# Altium project PRL_PDC.PrjPcb (part 1 of 2)
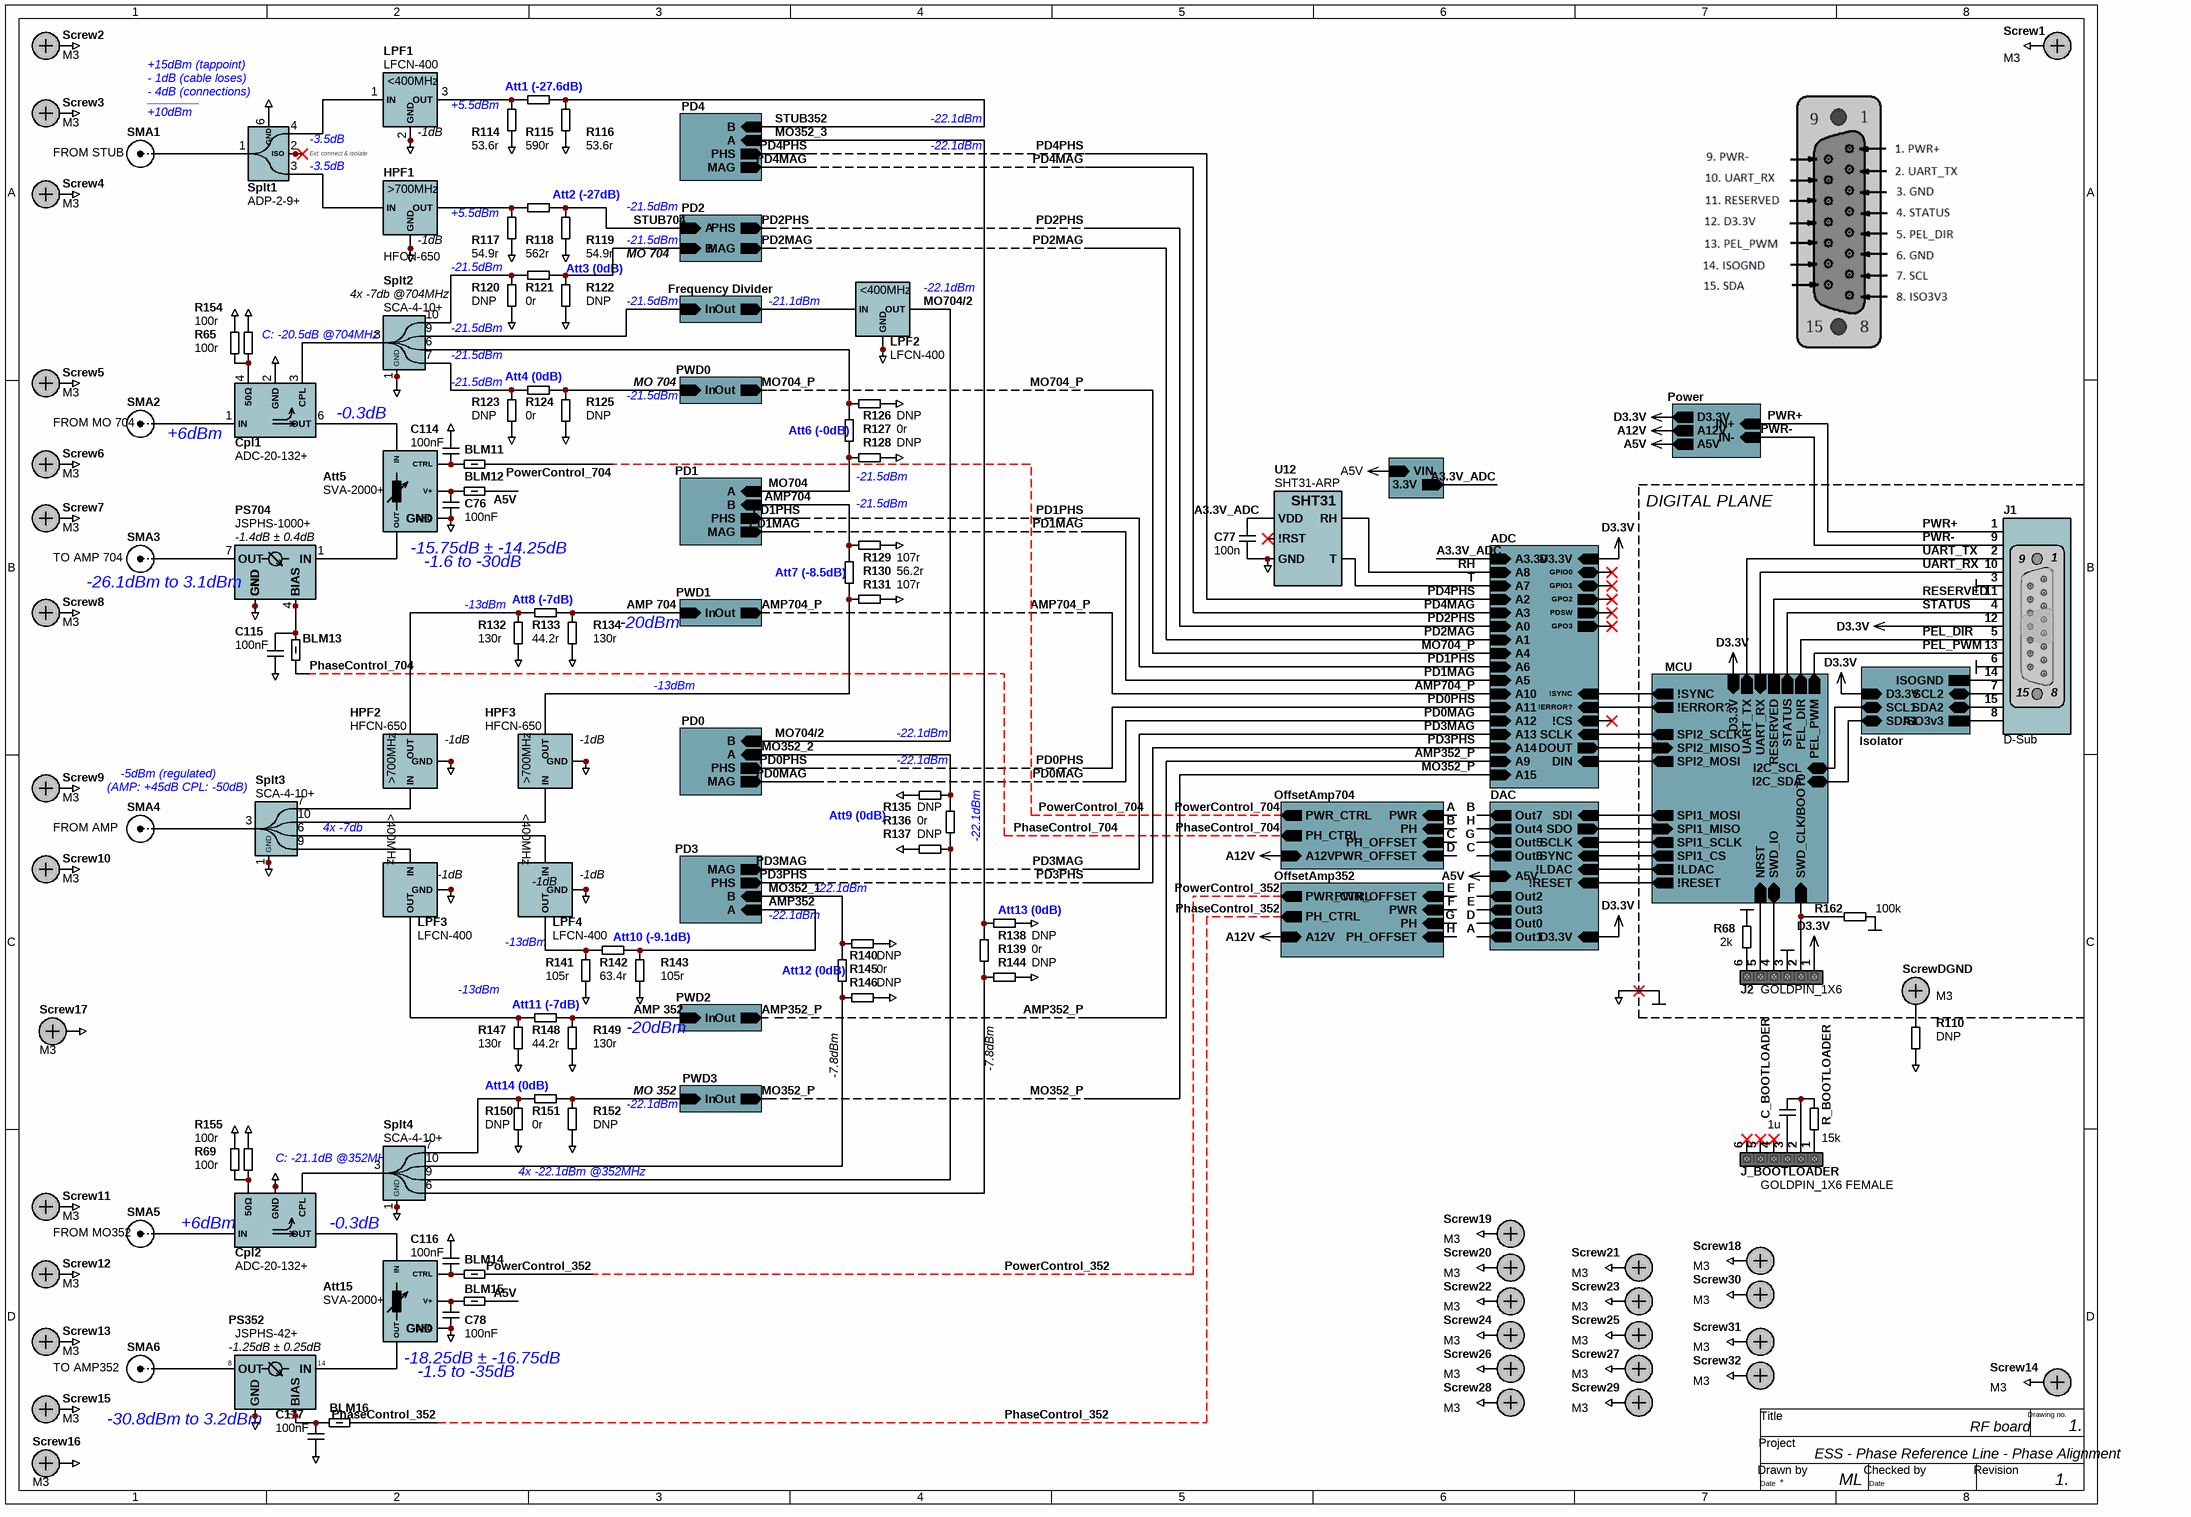
[diagram p0: RF.SchDoc]
Project_CopyrightDate: 2019; Project_DrawnBy: ML; Project_Engineer: Mateusz Lipinski; Project_Revision: 1; Project_Title: PRL Phase Drift Compensation
11 sheets, 570 parts. Net scope: hierarchical (ports join the sheet entries above them; power ports are global).
Board file: RF.PcbDoc
Sheets:
  RF.SchDoc
    PD2 = PhaseDetector.SchDoc
      A3.3V_PhD = LDO3v3.SchDoc
    PD1 = PhaseDetector.SchDoc
      A3.3V_PhD = LDO3v3.SchDoc
    PD3 = PhaseDetector.SchDoc
      A3.3V_PhD = LDO3v3.SchDoc
    PD0 = PhaseDetector.SchDoc
      A3.3V_PhD = LDO3v3.SchDoc
    Frequency Divider = FreqDiv.SchDoc
      A3.3V_FD = LDO3v3.SchDoc
    PD4 = PhaseDetector.SchDoc
      A3.3V_PhD = LDO3v3.SchDoc
    DAC = DAC.SchDoc
    ADC = ADC.SchDoc
    PWD0 = PowerDetector.SchDoc
      A3.3V_PD = LDO3v3.SchDoc
    PWD1 = PowerDetector.SchDoc
      A3.3V_PD = LDO3v3.SchDoc
    PWD2 = PowerDetector.SchDoc
      A3.3V_PD = LDO3v3.SchDoc
    PWD3 = PowerDetector.SchDoc
      A3.3V_PD = LDO3v3.SchDoc
    Power = Power.SchDoc
    MCU = MCU.SchDoc
    Isolator = Isolator.SchDoc
    A3.3V_ADC = LDO3v3.SchDoc
    OffsetAmp704 = OffsetAmplifier.SchDoc
    OffsetAmp352 = OffsetAmplifier.SchDoc

## Sheet RF.SchDoc
size 393 x 281 mm; DocumentNumber: 5; SheetNumber: 5; SheetTotal: 11

### Parts
Att5  SVA-2000+  [FZ990]
Att15  SVA-2000+  [FZ990]
BLM11  120 Ohms @ 100MHz  [0402-Inductor]  (value not drawn)
BLM12  120 Ohms @ 100MHz  [0402-Inductor]  (value not drawn)
BLM13  120 Ohms @ 100MHz  [0402-Inductor]  (value not drawn)
BLM14  120 Ohms @ 100MHz  [0402-Inductor]  (value not drawn)
BLM15  120 Ohms @ 100MHz  [0402-Inductor]  (value not drawn)
BLM16  120 Ohms @ 100MHz  [0402-Inductor]  (value not drawn)
C76  100nF  [0603-Capacitor]
C77  100n  [0402-Capacitor]
C78  100nF  [0603-Capacitor]
C114  100nF  [0603-Capacitor]
C115  100nF  [0603-Capacitor]
C116  100nF  [0603-Capacitor]
C117  100nF  [0603-Capacitor]
C_BOOTLOADER  1u  [0603-Capacitor]  (no BOM)
Cpl1  ADC-20-132+  [CD542]
Cpl2  ADC-20-132+  [CD542]
HPF1  HFCN-650  [FV1206]
HPF2  HFCN-650  [FV1206]
HPF3  HFCN-650  [FV1206]
J1  D-Sub  [AE10105-ND]
J2  GOLDPIN_1X6  [HDR_1x6 SMD]
J_BOOTLOADER  GOLDPIN_1X6 FEMALE  [HDR_1x6 SMD]  (no BOM)
LPF1  LFCN-400  [FV1206]
LPF2  LFCN-400  [FV1206]
LPF3  LFCN-400  [FV1206]
LPF4  LFCN-400  [FV1206]
PS352  JSPHS-42+  [BK276]
PS704  JSPHS-1000+  [BK276]
R65  100r  [0402-RESISTOR]
R68  2k  [0402-RESISTOR]
R69  100r  [0402-RESISTOR]
R110  DNP  [0402-RESISTOR]  (no BOM)
R114  53.6r  [0603-RESISTOR]
R115  590r  [0603-RESISTOR]
R116  53.6r  [0603-RESISTOR]
R117  54.9r  [0603-RESISTOR]
R118  562r  [0603-RESISTOR]
R119  54.9r  [0603-RESISTOR]
R120  DNP  [0603-RESISTOR]  (no BOM)
R121  0r  [0603-RESISTOR]
R122  DNP  [0603-RESISTOR]  (no BOM)
R123  DNP  [0603-RESISTOR]  (no BOM)
R124  0r  [0603-RESISTOR]
R125  DNP  [0603-RESISTOR]  (no BOM)
R126  DNP  [0603-RESISTOR]  (no BOM)
R127  0r  [0603-RESISTOR]
R128  DNP  [0603-RESISTOR]  (no BOM)
R129  107r  [0603-RESISTOR]
R130  56.2r  [0603-RESISTOR]
R131  107r  [0603-RESISTOR]
R132  130r  [0603-RESISTOR]
R133  44.2r  [0603-RESISTOR]
R134  130r  [0603-RESISTOR]
R135  DNP  [0603-RESISTOR]  (no BOM)
R136  0r  [0603-RESISTOR]
R137  DNP  [0603-RESISTOR]  (no BOM)
R138  DNP  [0603-RESISTOR]  (no BOM)
R139  0r  [0603-RESISTOR]
R140  DNP  [0603-RESISTOR]  (no BOM)
R141  105r  [0603-RESISTOR]
R142  63.4r  [0603-RESISTOR]
R143  105r  [0603-RESISTOR]
R144  DNP  [0603-RESISTOR]  (no BOM)
R145  0r  [0603-RESISTOR]
R146  DNP  [0603-RESISTOR]  (no BOM)
R147  130r  [0603-RESISTOR]
R148  44.2r  [0603-RESISTOR]
R149  130r  [0603-RESISTOR]
R150  DNP  [0603-RESISTOR]  (no BOM)
R151  0r  [0603-RESISTOR]
R152  DNP  [0603-RESISTOR]  (no BOM)
R154  100r  [0402-RESISTOR]
R155  100r  [0402-RESISTOR]
R162  100k  [0402-RESISTOR]
R_BOOTLOADER  15k  [0603-RESISTOR]  (no BOM)
Screw1  M3  [M3 Screw]
Screw2  M3  [M3 Screw]
Screw3  M3  [M3 Screw]
Screw4  M3  [M3 Screw]
Screw5  M3  [M3 Screw]
Screw6  M3  [M3 Screw]
Screw7  M3  [M3 Screw]
Screw8  M3  [M3 Screw]
Screw9  M3  [M3 Screw]
Screw10  M3  [M3 Screw]
Screw11  M3  [M3 Screw]
Screw12  M3  [M3 Screw]
Screw13  M3  [M3 Screw]
Screw14  M3  [M3 Screw]
Screw15  M3  [M3 Screw]
Screw16  M3  [M3 Screw]
Screw17  M3  [M3 Screw]
Screw18  M3  [M3 Screw]
Screw19  M3  [M3 Screw]
Screw20  M3  [M3 Screw]
Screw21  M3  [M3 Screw]
Screw22  M3  [M3 Screw]
Screw23  M3  [M3 Screw]
Screw24  M3  [M3 Screw]
Screw25  M3  [M3 Screw]
Screw26  M3  [M3 Screw]
Screw27  M3  [M3 Screw]
Screw28  M3  [M3 Screw]
Screw29  M3  [M3 Screw]
Screw30  M3  [M3 Screw]
Screw31  M3  [M3 Screw]
Screw32  M3  [M3 Screw]
ScrewDGND  M3  [M3 Screw]
SMA1  FROM STUB  [MC000242]
SMA2  FROM MO 704  [MC000242]
SMA3  TO AMP 704  [MC000242]
SMA4  FROM AMP  [MC000242]
SMA5  FROM MO352  [MC000242]
SMA6  TO AMP352  [MC000242]
Splt1  ADP-2-9+  [CD636]
Splt2  SCA-4-10+  [DZ943]
Splt3  SCA-4-10+  [DZ943]
Splt4  SCA-4-10+  [DZ943]
U12  SHT31-ARP  [TDFN-8 SHT3X-ARP]

### Sub-sheets
A3.3V_ADC = LDO3v3.SchDoc: 3.3V (out), VIN (in)
ADC = ADC.SchDoc: A11 (in), A13 (in), A0 (in), A6 (in), A3 (in), A2 (in), A5 (in), A12 (in), A10 (in), A1 (in), A8 (in), A14 (in), A4 (in), A7 (in), A15 (in), A9 (in), SCLK (in), DIN (in), DOUT (out), D3.3V (in), !ERROR? (in), !SYNC (in), A3.3V (in), GPIO0 (bidir), GPIO1 (bidir), GPO2 (out), PDSW (out), GPO3 (out), !CS (in)
DAC = DAC.SchDoc: Out4 (out), Out6 (out), Out2 (out), Out3 (out), Out7 (out), Out1 (out), Out0 (out), Out5 (out), !SYNC (in), SDI (in), SCLK (in), SDO (out), !LDAC (in), D3.3V (in), A5V (in), !RESET (in)
Frequency Divider = FreqDiv.SchDoc: In (in), Out (out)
Isolator = Isolator.SchDoc: SDA2 (bidir), ISO3v3, SCL2 (bidir), ISOGND, SDA1 (bidir), D3.3V (in), SCL1 (bidir)
MCU = MCU.SchDoc: NRST (in), SWD_CLK/BOOT0 (in), SWD_IO (bidir), !ERROR? (out), !SYNC (out), !LDAC (out), I2C_SDA (bidir), PEL_DIR (out), UART_TX (out), I2C_SCL (bidir), STATUS (out), PEL_PWM (out), RESERVED, UART_RX (in), D3.3V (in), SPI1_CS (out), SPI1_MOSI (out), SPI1_SCLK (out), SPI2_MISO (in), SPI2_SCLK (out), SPI2_MOSI (out), SPI1_MISO (in), !RESET (out)
OffsetAmp352 = OffsetAmplifier.SchDoc: PWR_OFFSET (in), PWR (in), PH_OFFSET (in), PH (in), PWR_CTRL (out), PH_CTRL (out), A12V (in)
OffsetAmp704 = OffsetAmplifier.SchDoc: PWR_OFFSET (in), PWR (in), PH_OFFSET (in), PH (in), PWR_CTRL (out), PH_CTRL (out), A12V (in)
PD0 = PhaseDetector.SchDoc: MAG (out), PHS (out), A (in), B (in)
PD1 = PhaseDetector.SchDoc: MAG (out), PHS (out), A (in), B (in)
PD2 = PhaseDetector.SchDoc: MAG (out), PHS (out), A (in), B (in)
PD3 = PhaseDetector.SchDoc: MAG (out), PHS (out), A (in), B (in)
PD4 = PhaseDetector.SchDoc: MAG (out), PHS (out), A (in), B (in)
Power = Power.SchDoc: IN- (in), IN+ (in), D3.3V (out), A12V (out), A5V (out)
PWD0 = PowerDetector.SchDoc: Out (out), In (in)
PWD1 = PowerDetector.SchDoc: Out (out), In (in)
PWD2 = PowerDetector.SchDoc: Out (out), In (in)
PWD3 = PowerDetector.SchDoc: In (in), Out (out)

### Nets
A5V: BLM12.2 BLM15.2 ; sheet DAC/A5V, sheet Power/A5V, sheet A3.3V_ADC/VIN
A12V: sheet Power/A12V, sheet OffsetAmp704/A12V, sheet OffsetAmp352/A12V
D3.3V: J1.12 J2.1 ; sheet DAC/D3.3V, sheet ADC/D3.3V, sheet Power/D3.3V, sheet MCU/D3.3V, sheet Isolator/D3.3V
DGND: Att5.2(GND) Att5.3(GND) Att5.5(GND) Att5.6(GND) Att5.7(GND) Att5.9(GND) Att5.10(GND) Att5.12(GND) Att15.2(GND) Att15.3(GND) Att15.5(GND) Att15.6(GND) Att15.7(GND) Att15.9(GND) Att15.10(GND) Att15.12(GND) C76.2 C77.1 C78.2 C114.1 C115.2 C116.1 C117.2 Cpl1.2(GND) Cpl2.2(GND) HPF1.2(GND) HPF1.4(GND) HPF2.2(GND) HPF2.4(GND) HPF3.2(GND) HPF3.4(GND) J1.3 J1.6 J2.3 LPF1.2(GND) LPF1.4(GND) LPF2.2(GND) LPF2.4(GND) LPF3.2(GND) LPF3.4(GND) LPF4.2(GND) LPF4.4(GND) PS352.2(GND) PS352.3(GND) PS352.4(GND) PS352.5(GND) PS352.6(GND) PS352.9(GND) PS352.10(GND) PS352.11(GND) PS352.12(GND) PS352.13(GND) PS704.2(GND) PS704.3(GND) PS704.5(GND) PS704.8(GND) PS704.9(GND) PS704.10(GND) PS704.11(GND) PS704.12(GND) PS704.13(GND) PS704.14(GND) R65.2 R68.1 R69.2 R110.2 R114.1 R116.1 R117.1 R119.1 R120.1 R122.1 R123.1 R125.1 R126.1 R128.1 R129.1 R131.1 R132.1 R134.1 R135.1 R137.1 R138.1 R140.1 R141.1 R143.1 R144.1 R146.1 R147.1 R149.1 R150.1 R152.1 R154.2 R155.2 R162.1 Screw1.0 Screw2.0 Screw3.0 Screw4.0 Screw5.0 Screw6.0 Screw7.0 Screw8.0 Screw9.0 Screw10.0 Screw11.0 Screw12.0 Screw13.0 Screw14.0 Screw15.0 Screw16.0 Screw17.0 Screw18.0 Screw19.0 Screw20.0 Screw21.0 Screw22.0 Screw23.0 Screw24.0 Screw25.0 Screw26.0 Screw27.0 Screw28.0 Screw29.0 Screw30.0 Screw31.0 Screw32.0 Splt1.6(GND) Splt2.1(GND) Splt2.2(GND) Splt2.4(GND) Splt2.5(GND) Splt2.8(GND) Splt3.1(GND) Splt3.2(GND) Splt3.4(GND) Splt3.5(GND) Splt3.8(GND) Splt4.1(GND) Splt4.2(GND) Splt4.4(GND) Splt4.5(GND) Splt4.8(GND) U12.2(GND) U12.3(GND) U12.7(GND) U12.8(GND) U12.EP  [also labelled GND]
A: sheet DAC/Out1, sheet OffsetAmp704/PWR
A3.3V_ADC: C77.2 U12.5(VDD) ; sheet ADC/A3.3V, sheet A3.3V_ADC/3.3V
AMP352: R142.2 R143.2 ; sheet PD3/A
AMP352_P: sheet ADC/A9, sheet PWD2/Out
AMP704: R129.2 R130.2 ; sheet PD1/B
AMP704_P: sheet ADC/A10, sheet PWD1/Out
B: sheet DAC/Out7, sheet OffsetAmp704/PH
C: sheet DAC/Out6, sheet OffsetAmp704/PH_OFFSET
D: sheet DAC/Out0, sheet OffsetAmp704/PWR_OFFSET
E: sheet DAC/Out3, sheet OffsetAmp352/PWR_OFFSET
F: sheet DAC/Out2, sheet OffsetAmp352/PWR
G: sheet DAC/Out5, sheet OffsetAmp352/PH
H: sheet DAC/Out4, sheet OffsetAmp352/PH_OFFSET
MO352_1: R140.2 R145.2 ; sheet PD3/B
MO352_2: R135.2 R136.2 ; sheet PD0/A
MO352_3: R138.2 R139.2 ; sheet PD4/A
MO352_P: sheet ADC/A15, sheet PWD3/Out
MO704: R127.1 R128.2 ; sheet PD1/A
MO704/2: LPF2.3(OUT) ; sheet PD0/B
MO704_P: sheet ADC/A4, sheet PWD0/Out
NRST: J2.5 ; sheet MCU/NRST
PD0MAG: sheet PD0/MAG, sheet ADC/A12
PD0PHS: sheet PD0/PHS, sheet ADC/A11
PD1MAG: sheet PD1/MAG, sheet ADC/A5
PD1PHS: sheet PD1/PHS, sheet ADC/A6
PD2MAG: sheet PD2/MAG, sheet ADC/A1
PD2PHS: sheet PD2/PHS, sheet ADC/A0
PD3MAG: sheet PD3/MAG, sheet ADC/A13
PD3PHS: sheet PD3/PHS, sheet ADC/A14
PD4MAG: sheet PD4/MAG, sheet ADC/A3
PD4PHS: sheet PD4/PHS, sheet ADC/A2
PEL_DIR: J1.5 ; sheet MCU/PEL_DIR
PEL_PWM: J1.13 ; sheet MCU/PEL_PWM
PhaseControl_352: BLM16.2 ; sheet OffsetAmp352/PH_CTRL
PhaseControl_704: BLM13.1 ; sheet OffsetAmp704/PH_CTRL
PowerControl_352: BLM14.2 ; sheet OffsetAmp352/PWR_CTRL
PowerControl_704: BLM11.1 ; sheet OffsetAmp704/PWR_CTRL
PWR+: J1.1 ; sheet Power/IN+
PWR-: J1.9 ; sheet Power/IN-
RESERVED: J1.11 ; sheet MCU/RESERVED
RH: U12.1(RH) ; sheet ADC/A8
STATUS: J1.4 ; sheet MCU/STATUS
STUB352: R115.2 R116.2 ; sheet PD4/B
STUB704: R118.2 R119.2 ; sheet PD2/A
T: U12.4(T) ; sheet ADC/A7
UART_RX: J1.10 ; sheet MCU/UART_RX
UART_TX: J1.2 ; sheet MCU/UART_TX
NetAtt5_1: Att5.1(OUT) PS704.1(IN)
NetAtt5_4: Att5.4(CTRL) BLM11.2 C114.2
NetAtt5_8: Att5.8(IN) Cpl1.6(OUT)
NetAtt5_11: Att5.11(V+) BLM12.1 C76.1
NetAtt15_1: Att15.1(OUT) PS352.14(IN)
NetAtt15_4: Att15.4(CTRL) BLM14.1 C116.2
NetAtt15_8: Att15.8(IN) Cpl2.6(OUT)
NetAtt15_11: Att15.11(V+) BLM15.1 C78.1
NetBLM13_2: BLM13.2 C115.1 PS704.4(BIAS) PS704.6(BIAS)
NetBLM16_1: BLM16.1 C117.1 PS352.1(BIAS) PS352.7(BIAS)
NetC8_PD2_1: R121.2 R122.2 ; sheet PD2/B
NetC71_PWD0_1: R124.2 R125.2 ; sheet PWD0/In
NetC71_PWD1_1: R133.2 R134.2 ; sheet PWD1/In
NetC71_PWD2_1: R148.2 R149.2 ; sheet PWD2/In
NetC71_PWD3_1: R151.2 R152.2 ; sheet PWD3/In
NetC80_1: J1.14 ; sheet Isolator/ISOGND
NetC80_2: J1.8 ; sheet Isolator/ISO3v3
NetC_BOOTLOADER_1: C_BOOTLOADER.1 J_BOOTLOADER.3
NetC_BOOTLOADER_2: C_BOOTLOADER.2 J_BOOTLOADER.2 R_BOOTLOADER.2
NetCpl1_1: Cpl1.1(IN) SMA2.0(RF)
NetCpl1_3: Cpl1.3(CPL) Splt2.3(S)
NetCpl1_4: Cpl1.4(50Ω) R65.1 R154.1
NetCpl2_1: Cpl2.1(IN) SMA5.0(RF)
NetCpl2_3: Cpl2.3(CPL) Splt4.3(S)
NetCpl2_4: Cpl2.4(50Ω) R69.1 R155.1
NetHPF1_1: HPF1.1(IN) Splt1.3(P1)
NetHPF1_3: HPF1.3(OUT) R117.2 R118.1
NetHPF2_1: HPF2.1(IN) Splt3.7(P2)
NetHPF2_3: HPF2.3(OUT) R132.2 R133.1
NetHPF3_1: HPF3.1(IN) Splt3.10(P4)
NetHPF3_3: HPF3.3(OUT) R130.1 R131.2
NetJ1_7: J1.7 ; sheet Isolator/SCL2
NetJ1_15: J1.15 ; sheet Isolator/SDA2
NetJ2_2: J2.2 R162.2 ; sheet MCU/SWD_CLK/BOOT0
NetJ2_4: J2.4 ; sheet MCU/SWD_IO
NetJ2_6: J2.6 R68.2
NetJ_BOOTLOADER_1: J_BOOTLOADER.1 R_BOOTLOADER.1
NetLPF1_1: LPF1.1(IN) Splt1.4(P2)
NetLPF1_3: LPF1.3(OUT) R114.2 R115.1
NetLPF2_1: LPF2.1(IN) ; sheet Frequency Divider/Out
NetLPF3_1: LPF3.1(IN) Splt3.9(P3)
NetLPF3_3: LPF3.3(OUT) R147.2 R148.1
NetLPF4_1: LPF4.1(IN) Splt3.6(P1)
NetLPF4_3: LPF4.3(OUT) R141.2 R142.1
NetPS352_8: PS352.8(OUT) SMA6.0(RF)
NetPS704_7: PS704.7(OUT) SMA3.0(RF)
NetR23_2: sheet DAC/!RESET, sheet MCU/!RESET
NetR83_1: sheet ADC/SCLK, sheet MCU/SPI2_SCLK
NetR84_1: sheet ADC/DIN, sheet MCU/SPI2_MOSI
NetR85_1: sheet ADC/DOUT, sheet MCU/SPI2_MISO
NetR86_1: sheet DAC/SDI, sheet MCU/SPI1_MOSI
NetR87_1: sheet DAC/SDO, sheet MCU/SPI1_MISO
NetR88_1: sheet DAC/SCLK, sheet MCU/SPI1_SCLK
NetR89_1: sheet DAC/!SYNC, sheet MCU/SPI1_CS
NetR92_1: sheet MCU/I2C_SDA, sheet Isolator/SDA1
NetR94_1: sheet MCU/I2C_SCL, sheet Isolator/SCL1
NetR105_1: sheet ADC/!ERROR?, sheet MCU/!ERROR?
NetR106_1: sheet ADC/!SYNC, sheet MCU/!SYNC
NetR107_1: sheet DAC/!LDAC, sheet MCU/!LDAC
NetR110_1: R110.1 ScrewDGND.0
NetR120_2: R120.2 R121.1 Splt2.10(P4)
NetR123_2: R123.2 R124.1 Splt2.7(P2)
NetR126_2: R126.2 R127.2 Splt2.6(P1)
NetR136_1: R136.1 R137.2 Splt4.9(P3)
NetR139_1: R139.1 R144.2 Splt4.6(P1)
NetR145_1: R145.1 R146.2 Splt4.10(P4)
NetR150_2: R150.2 R151.1 Splt4.7(P2)
NetSMA1_0: SMA1.0(RF) Splt1.1(SUM)
NetSMA4_0: SMA4.0(RF) Splt3.3(S)
NetSplt1_2: Splt1.2(ISO) Splt1.5(ISO)
NetSplt2_9: Splt2.9(P3) ; sheet Frequency Divider/In

Not connected (* = marked no-connect by the designer): Cpl1 5(ISOL); Cpl2 5(ISOL); J_BOOTLOADER 4* 5* 6*; U12 6(!RST)*

### Notes on the sheet
- +15dBm (tappoint)
- (near Splt1) - 1dB (cable loses)
- (near Splt1) - 4dB (connections)
- ________
- +5.5dBm
- (near R115) Att1 (-27.6dB)
- (near SMA1) +10dBm
- (near Splt1) -3.5dB
- Ext. connect & isolate
- (near LPF1) -1dB
- -22.1dBm
- (near HPF1) -1dB
- (near R118) Att2 (-27dB)
- -21.5dBm
- (near Splt2) 4x -7db @704MHz
- Att3 (0dB)
- MO 704
- (near LPF2) -21.1dBm
- (near LPF2) -22.1dBm
- C: -20.5dB @704MHz
- (near R124) Att4 (0dB)
- (near SMA2) +6dBm
- -0.3dB
- (near R123) -21.5dBm
- (near R127) Att6 (-0dB)
- (near R128) -21.5dBm
- DIGITAL PLANE
- (near PS704) -26.1dBm to 3.1dBm
- (near PS704) -1.4dB ± 0.4dB
- (near Att5) -15.75dB ± -14.25dB
- (near Att5) -1.6 to -30dB
- (near R130) Att7 (-8.5dB)
- -13dBm
- (near R133) Att8 (-7dB)
- -20dBm
- AMP 704
- -5dBm (regulated)
- (near HPF2) -1dB
- (near HPF3) -1dB
- (near Splt3) (AMP: +45dB CPL: -50dB)
- (near Splt3) 4x -7db
- Att9 (0dB)
- PowerControl_704
- PhaseControl_704
- (near LPF3) -1dB
- (near LPF4) -1dB
- (near R138) Att13 (0dB)
- (near LPF4) -13dBm
- (near R142) Att10 (-9.1dB)
- (near R145) Att12 (0dB)
- (near R148) Att11 (-7dB)
- (near R143) AMP 352
- (near R151) Att14 (0dB)
- MO 352
- -17.8dBm
- -7.8dBm
- (near Splt4) C: -21.1dB @352MHz
- 4x -22.1dBm @352MHz
- (near Cpl2) +6dBm
- PowerControl_352
- (near PS352) -1.25dB ± 0.25dB
- (near Att15) -18.25dB ± -16.75dB
- (near Att15) -1.5 to -35dB
- (near PS352) -30.8dBm to 3.2dBm
- PhaseControl_352
- ESS - Phase Reference Line - Phase Alignment
- (near Screw14) RF board
- (near Screw14) 1.
- ML
- 1.
- Title
- Project
- Drawing no.
- Date
- Drawn by
- Checked by
- Revision
- (in symbol HFCN-650) >700MHz
- (in symbol LFCN-400) <400MHz

### Library data of the parts
Att5 Att15 = SVA-2000+: Voltage Variable Attenuator / 50Ω 50 to 2000 MHz; Case: FZ990; HelpURL: https://www.minicircuits.com/pdfs/SVA-2000+.pdf; Supplier Part Number 1: SVA-2000+; Supplier 1: Mini-Circuits
BLM11-BLM16 = BLM15AX121SZ1D: 120 Ohms @ 100MHz 1 Power, Signal Line Ferrite Bead 0402 (1005 Metric) 700mA 130mOhm; Case: 0402; Supplier 1: Digi-Key; Supplier Part Number 1: 490-16510-1-ND; HelpURL: https://www.murata.com/en-us/products/productdata/8796748677150/QNFA9118.pdf
C76 C78 C114-C117 = C_0603: Capacitor 0603; Tolerance: ±20%; Voltage Rating: 16V; Dielectric: X7R/C0G; Value: 100nF; Case: 0603
C77 = C_0402: Capacitor 0402; Tolerance: ±20%; Voltage Rating: 16V; Dielectric: X7R/C0G; Value: 100n; Case: 0402
C_BOOTLOADER = C_0603: Capacitor 0603; Dielectric: X7R/C0G; Voltage Rating: 16V; Tolerance: ±20%; Value: 1u; Case: 0603
Cpl1 Cpl2 = ADC-20-132+: 20 dB SMT Directional Coupler, 100 - 1300 MHz, 50Ω; HelpURL: https://www.minicircuits.com/pdfs/ADC-20-132+.pdf; Supplier 1: Mini-Circuits; Supplier Part Number 1: ADC-20-132+; Case: CD542
HPF1-HPF3 = HFCN-650: Ceramic High Pass Filter / • 50Ω / • 710 to 2490 MHz; HelpURL: https://www.minicircuits.com/pdfs/HFCN-650.pdf; Supplier 1: Mini-Circuits; Supplier Part Number 1: HFCN-650; Case: FV1206
J1 = A-DF 15 AA-WP: 15 Position D-Sub Plug, Female Pins Connector; HelpURL: http://www.assmann-wsw.com/fileadmin/datasheets/ASS_3251_CO.pdf; Supplier 1: Digi-Key; Supplier Part Number 1: AE10105-ND
J_BOOTLOADER = GOLDPIN_1X6: HelpURL: https://www.metz-connect.com/us/system/files/productfiles/Data_sheet_PM202XXVBNN.PDF; Supplier 1: Digi-Key; Supplier Part Number 1: 1849-1036-ND
LPF1-LPF4 = LFCN-400: Ceramic Low Pass Filter / • 50Ω / • DC to 400 MHz; HelpURL: https://ww2.minicircuits.com/pdfs/LFCN-400.pdf; Supplier 1: Mini-Circuits; Supplier Part Number 1: LFCN-400; Case: FV1206
PS352 = JSPHS-42+: Narrow Band Phase Shifter / • 50 Ohm / • 180 deg Voltage Variable / • 300 MHz to 400 MHz /; HelpURL: https://ww2.minicircuits.com/pdfs/JSPHS-42+.pdf; Supplier 1: Mini-Circuits; Supplier Part Number 1: JSPHS-42+; Case: BK276
PS704 = JSPHS-1000+: Narrow Band Phase Shifter / • 50 Ohm / • 180 deg Voltage Variable / • 700 MHz to 1000 MHz /; HelpURL: https://ww2.minicircuits.com/pdfs/JSPHS-1000+.pdf; Supplier 1: Mini-Circuits; Supplier Part Number 1: JSPHS-1000+; Case: BK276
R65 R68 R69 R154 R155 R162 = R_0402: Resistor 0402; Tolerance: ±1%; Case: 0402
  R65 R69 R154 R155: Value: 100r
  R68: Value: 2k
  R162: Value: 100k
R110 = R_0402: Resistor 0402; Value: 0r; Tolerance: ±1%; Case: 0402
R114-R119 R121 R124 R127 R129-R134 R136 R139 R141-R143 R145 R147-R149 R151 = R_0603: Resistor 0603; Tolerance: ±1%; Case: 0603
  R114 R116: Value: 53.6r
  R115: Value: 590r
  R117 R119: Value: 54.9r
  R118: Value: 562r
  R121 R124 R127 R136 R139 R145 R151: Value: 0r
  R129 R131: Value: 107r
  R130: Value: 56.2r
  R132 R134 R147 R149: Value: 130r
  R133 R148: Value: 44.2r
  R141 R143: Value: 105r
  R142: Value: 63.4r
R120 R122 R123 R125 R126 R128 R135 R137 R138 R140 R146 R150 R152 = R_0603: Resistor 0603; Value: 50r; Tolerance: ±1%; Case: 0603
R144 = R_0603: Resistor 0603; Value: 392r; Tolerance: ±1%; Case: 0603
R_BOOTLOADER = R_0603: Resistor 0603; Value: 15k; Case: 0603
Screw1-Screw32 ScrewDGND = M3 Screw
SMA1-SMA6 = MC000242: SMA Bulkhead Jack / Front Mount; HelpURL: http://www.farnell.com/datasheets/1686097.pdf?_ga=2.110163462.2015351761.1577118285-755396856.1571840580; Supplier 1: Farnell; Supplier Part Number 1: 2253765
Splt1 = ADP-2-9+: Power Splitter/Combiner / • 2 Way-0° / • 50Ω / • 200 to 900 MHz; HelpURL: https://ww2.minicircuits.com/pdfs/ADP-2-9+.pdf; Supplier 1: Mini-Circuits; Supplier Part Number 1: ADP-2-9+; Case: CD636
Splt2-Splt4 = SCA-4-10+: Power Splitter/Combiner / • 4 Way / • 50Ω / • 5 to 1000 MHz; HelpURL: https://www.minicircuits.com/pdfs/SCA-4-10+.pdf; Supplier 1: Mini-Circuits; Supplier Part Number 1: SCA-4-10+; Case: DZ943
U12 = SHT31: Humidity and Temperature Sensor IC; HelpURL: https://media.digikey.com/pdf/Data%20Sheets/Sensirion%20PDFs/HT_DS_SHT3x_ARP_V3.pdf; Case: 8-DFN; Supplier 1: Digi-Key; Supplier Part Number 1: 1649-1012-1-ND
J2 = GOLDPIN_1X6: HelpURL: https://www.metz-connect.com/us/system/files/productfiles/Data_sheet_PM202XXVBNN.PDF; Supplier 1: Digi-Key; Supplier Part Number 1: 1849-1036-ND

## Sheet PhaseDetector.SchDoc
size 193 x 146 mm; DocumentNumber: 2; SheetNumber: 2; SheetTotal: 11
Used 5 times, as channels PD2, PD1, PD3, PD0, PD4. Parts and nets are listed once, with the designators drawn on the sheet.
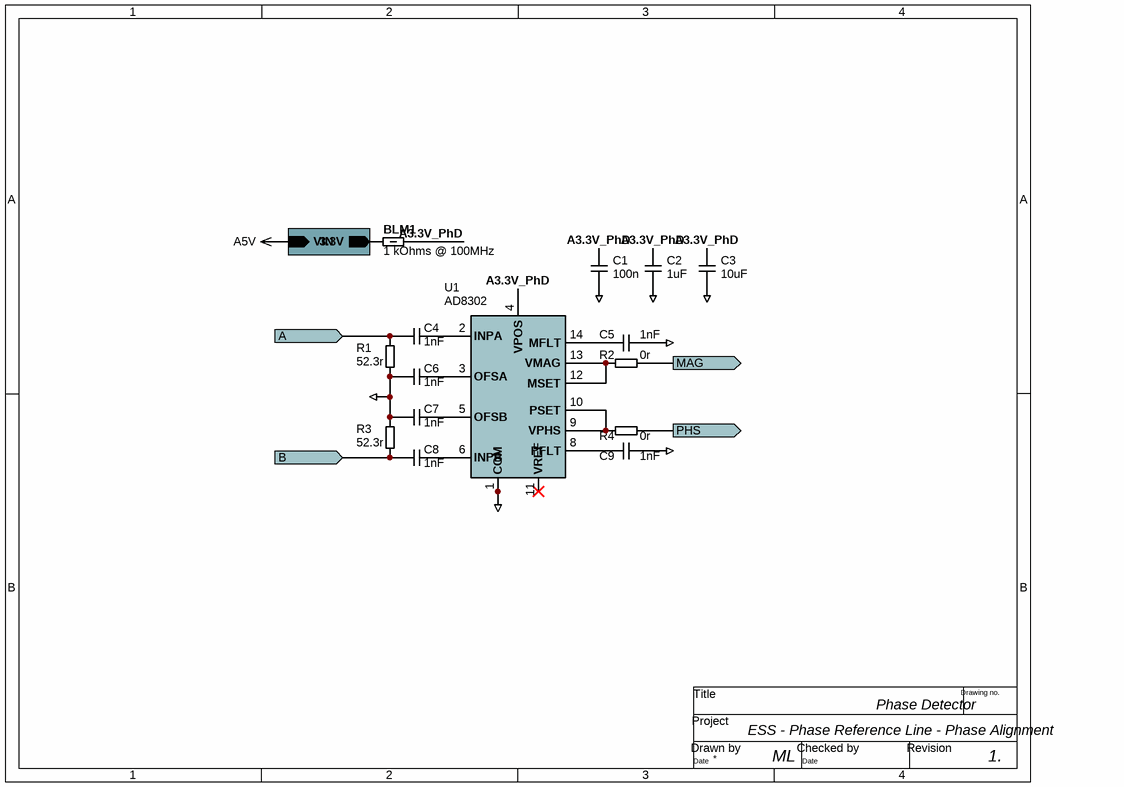
[diagram p1: PhaseDetector.SchDoc]

### Parts
BLM1  1 kOhms @ 100MHz  [0402-Inductor]
C1  100n  [0402-Capacitor]
C2  1uF  [0603-Capacitor]
C3  10uF  [1206-capacitor]
C4  1nF  [0603-Capacitor]
C5  1nF  [0603-Capacitor]
C6  1nF  [0603-Capacitor]
C7  1nF  [0603-Capacitor]
C8  1nF  [0603-Capacitor]
C9  1nF  [0603-Capacitor]
R1  52.3r  [0603-RESISTOR]
R2  0r  [0603-RESISTOR]
R3  52.3r  [0603-RESISTOR]
R4  0r  [0603-RESISTOR]
U1  AD8302  [TSSOP14]

### Sub-sheets
A3.3V_PhD = LDO3v3.SchDoc: 3.3V (out), VIN (in)

### Ports
A (in), B (in), MAG (out), PHS (out)

### Nets
GND: C1.1 C2.1 C3.1 C5.2 C6.1 C7.1 C9.2 R1.1 R3.2 U1.1(COM) U1.7(COM)
A: C4.1 R1.2 ; port A
A3.3V_PhD: BLM1.2 C1.2 C2.2 C3.2 U1.4(VPOS)  [project net A3.3V_PhD_2]
B: C8.1 R3.1 ; port B
MAG: R2.1 ; port MAG
PHS: R4.1 ; port PHS
NetBLM1_1: BLM1.1 ; sheet A3.3V_PhD/3.3V
NetC4_2: C4.2 U1.2(INPA)
NetC5_1: C5.1 U1.14(MFLT)
NetC6_2: C6.2 U1.3(OFSA)
NetC7_2: C7.2 U1.5(OFSB)
NetC8_2: C8.2 U1.6(INPB)
NetC9_1: C9.1 U1.8(PFLT)
NetR2_2: R2.2 U1.12(MSET) U1.13(VMAG)
NetR4_2: R4.2 U1.9(VPHS) U1.10(PSET)

Not connected (* = marked no-connect by the designer): U1 11(VREF)*

### Channels
PD2: designators end in _PD2; ports A=STUB704 B=NetC8_PD2_1 MAG=PD2MAG PHS=PD2PHS
PD1: designators end in _PD1; ports A=MO704 B=AMP704 MAG=PD1MAG PHS=PD1PHS
PD3: designators end in _PD3; ports A=AMP352 B=MO352_1 MAG=PD3MAG PHS=PD3PHS
PD0: designators end in _PD0; ports A=MO352_2 B=MO704/2 MAG=PD0MAG PHS=PD0PHS
PD4: designators end in _PD4; ports A=MO352_3 B=STUB352 MAG=PD4MAG PHS=PD4PHS

### Notes on the sheet
- ESS - Phase Reference Line - Phase Alignment
- Phase Detector
- ML
- 1.
- Title
- Project
- Drawing no.
- Date
- Drawn by
- Checked by
- Revision

### Library data of the parts
BLM1 = BLM15AG102SZ1D: 1 kOhms @ 100MHz 1 Signal Line Ferrite Bead 0402 (1005 Metric) 300mA 650mOhm; Case: 0402; Supplier 1: Digi-Key; Supplier Part Number 1: 490-16511-1-ND; HelpURL: https://www.murata.com/en-us/products/productdata/8796748677150/QNFA9118.pdf
C1 = C_0402: as C77 on sheet RF; Value: 100n; Case: 0402
C2 C4-C9 = C_0603: as C76 on sheet RF; Case: 0603
  C2: Value: 1uF
  C4-C9: Value: 1nF
C3 = C_1206: Capacitor 1206; Voltage Rating: 16V; Tolerance: ±20%; Dielectric: X7R/C0G; Value: 10uF; Case: 1206
R1-R4 = R_0603: Resistor 0603; Tolerance: ±1%; Case: 0603
  R1 R3: Value: 52.3r
  R2 R4: Value: 0r
U1 = AD8302: RF/IF Gain and Phase Detector / • LF–2.7 GHz /; HelpURL: https://www.analog.com/media/en/technical-documentation/data-sheets/ad8302.pdf; Supplier 1: Farnell; Supplier Part Number 1: 1498702; Case: TSSOP14

## Sheet LDO3v3.SchDoc
size 193 x 146 mm; DocumentNumber: 9; SheetNumber: 9; SheetTotal: 11
Used 11 times, as channels PD2/A3.3V_PhD, PD1/A3.3V_PhD, PD3/A3.3V_PhD, PD0/A3.3V_PhD, Frequency Divider/A3.3V_FD, PD4/A3.3V_PhD, PWD0/A3.3V_PD, PWD1/A3.3V_PD, PWD2/A3.3V_PD, PWD3/A3.3V_PD, A3.3V_ADC. Parts and nets are listed once, with the designators drawn on the sheet.
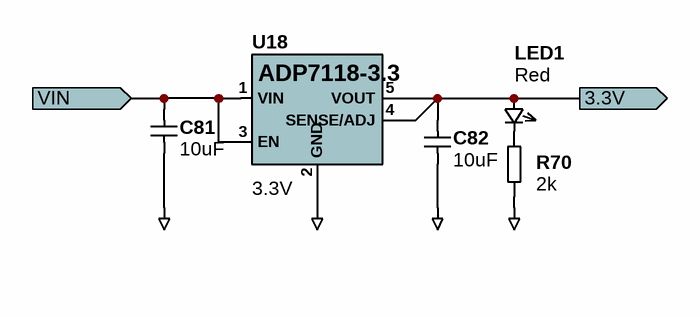
[diagram p2: LDO3v3.SchDoc]

### Parts
C81  10uF  [1206-capacitor]
C82  10uF  [1206-capacitor]
LED1  Red  [LED0603]
R70  2k  [0402-RESISTOR]
U18  3.3V  [SOT-23-5]

### Ports
3.3V (out), VIN (in)

### Nets
GND: C81.2 C82.2 R70.1 U18.2(GND)
3.3V: C82.1 LED1.A U18.4(SENSE/ADJ) U18.5(VOUT) ; port 3.3V
VIN: C81.1 U18.1(VIN) U18.3(EN) ; port VIN
NetLED1_K: LED1.K R70.2

### Channels
PD2/A3.3V_PhD: designators end in _PD2_A3.3V_PhD; ports 3.3V=NetBLM1_PD2_1 VIN=A5V
PD1/A3.3V_PhD: designators end in _PD1_A3.3V_PhD; ports 3.3V=NetBLM1_PD1_1 VIN=A5V
PD3/A3.3V_PhD: designators end in _PD3_A3.3V_PhD; ports 3.3V=NetBLM1_PD3_1 VIN=A5V
PD0/A3.3V_PhD: designators end in _PD0_A3.3V_PhD; ports 3.3V=NetBLM1_PD0_1 VIN=A5V
Frequency Divider/A3.3V_FD: designators end in _A3.3V_FD; ports 3.3V=NetBLM8_2 VIN=A5V
PD4/A3.3V_PhD: designators end in _PD4_A3.3V_PhD; ports 3.3V=NetBLM1_PD4_1 VIN=A5V
PWD0/A3.3V_PD: designators end in _PWD0_A3.3V_PD; ports 3.3V=NetBLM10_PWD0_2 VIN=A5V
PWD1/A3.3V_PD: designators end in _PWD1_A3.3V_PD; ports 3.3V=NetBLM10_PWD1_2 VIN=A5V
PWD2/A3.3V_PD: designators end in _PWD2_A3.3V_PD; ports 3.3V=NetBLM10_PWD2_2 VIN=A5V
PWD3/A3.3V_PD: designators end in _PWD3_A3.3V_PD; ports 3.3V=NetBLM10_PWD3_2 VIN=A5V
A3.3V_ADC: designators end in _A3.3V_ADC; ports 3.3V=A3.3V_ADC VIN=A5V

### Notes on the sheet
- Title
- Project
- Drawing no.
- Date
- Drawn by
- Checked by
- Revision

### Library data of the parts
C81 C82 = C_1206: as C3 on sheet PhaseDetector; Value: 10uF; Case: 1206
LED1 = LED0603: Color: Red; Case: 0603
R70 = R_0402: Resistor 0402; Tolerance: ±1%; Value: 2k; Case: 0402
U18 = ADP7118-3.3: 20 V, 200 mA, Low Noise, / CMOS LDO Linear Regulator; HelpURL: https://www.analog.com/media/en/technical-documentation/data-sheets/adp7118.pdf; Case: TSOT-23-5; Supplier 1: Digi-Key; Supplier Part Number 1: ADP7118AUJZ-3.3-R7CT-ND; Value: 3.3V

## Sheet FreqDiv.SchDoc
size 193 x 146 mm; DocumentNumber: 4; SheetNumber: 4; SheetTotal: 11
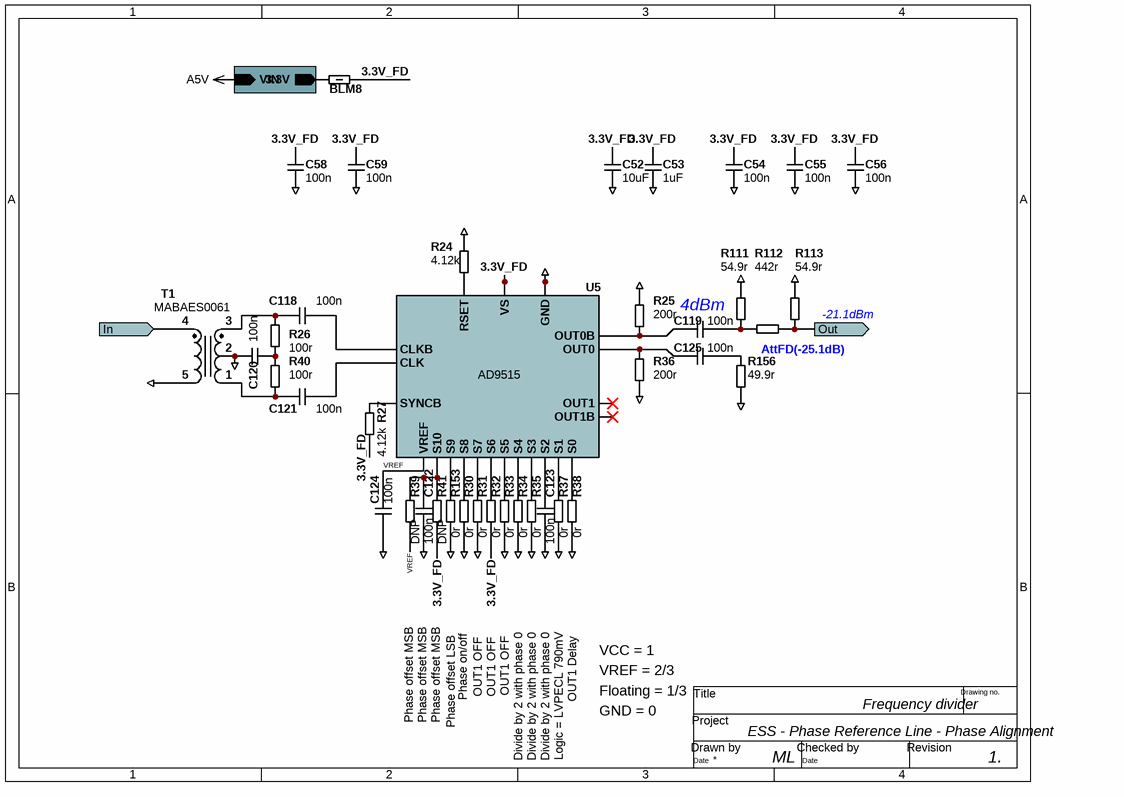
[diagram p3: FreqDiv.SchDoc]

### Parts
BLM8  120 Ohms @ 100MHz  [0402-Inductor]  (value not drawn)
C52  10uF  [1206-capacitor]
C53  1uF  [0603-Capacitor]
C54  100n  [0402-Capacitor]
C55  100n  [0402-Capacitor]
C56  100n  [0402-Capacitor]
C58  100n  [0402-Capacitor]
C59  100n  [0402-Capacitor]
C118  100n  [0402-Capacitor]
C119  100n  [0402-Capacitor]
C120  100n  [0402-Capacitor]
C121  100n  [0402-Capacitor]
C122  100n  [0402-Capacitor]
C123  100n  [0402-Capacitor]
C124  100n  [0402-Capacitor]
C125  100n  [0402-Capacitor]
R24  4.12k  [0402-RESISTOR]
R25  200r  [0402-RESISTOR]
R26  100r  [0402-RESISTOR]
R27  4.12k  [0402-RESISTOR]
R30  0r  [0402-RESISTOR]
R31  0r  [0402-RESISTOR]
R32  0r  [0402-RESISTOR]
R33  0r  [0402-RESISTOR]
R34  0r  [0402-RESISTOR]
R35  0r  [0402-RESISTOR]
R36  200r  [0402-RESISTOR]
R37  0r  [0402-RESISTOR]
R38  0r  [0402-RESISTOR]
R39  DNP  [0402-RESISTOR]  (no BOM)
R40  100r  [0402-RESISTOR]
R41  DNP  [0402-RESISTOR]  (no BOM)
R111  54.9r  [0603-RESISTOR]
R112  442r  [0603-RESISTOR]
R113  54.9r  [0603-RESISTOR]
R153  0r  [0402-RESISTOR]
R156  49.9r  [0402-RESISTOR]
T1  MABAES0061  [MABAES0061]
U5  AD9515  [LFCSP-32]

### Sub-sheets
A3.3V_FD = LDO3v3.SchDoc: 3.3V (out), VIN (in)

### Ports
In (in), Out (out)

### Nets
GND: C52.2 C53.2 C54.2 C55.2 C56.2 C58.2 C59.2 C120.2 C122.2 C123.2 C124.2 R24.2 R25.1 R30.2 R31.2 R33.2 R34.2 R35.2 R36.2 R37.2 R38.2 R111.1 R113.1 R153.2 R156.1 T1.2 T1.5 U5.31(GND) U5.EP  [project net DGND]
3.3V_FD: BLM8.1 C52.1 C53.1 C54.1 C55.1 C56.1 C58.1 C59.1 R27.2 R32.2 R41.2 U5.1(VS) U5.4(VS) U5.17(VS) U5.20(VS) U5.21(VS) U5.24(VS) U5.26(VS) U5.29(VS) U5.30(VS)  [project net 3.3V_FD_4]
VREF: C124.1 R39.2 U5.6(VREF)  [project net VREF_4]
NetBLM8_2: BLM8.2 ; sheet A3.3V_FD/3.3V
NetC118_1: C118.1 U5.3(CLKB)
NetC118_2: C118.2 R26.1 T1.3
NetC119_1: C119.1 R111.2 R112.1
NetC119_2: C119.2 R25.2 U5.22(OUT0B)
NetC120_1: C120.1 R26.2 R40.1
NetC121_1: C121.1 U5.2(CLK)
NetC121_2: C121.2 R40.2 T1.1
NetC122_1: C122.1 R39.1 R41.1 U5.7(S10)
NetC123_1: C123.1 U5.15(S2)
NetC125_1: C125.1 R156.2
NetC125_2: C125.2 R36.1 U5.23(OUT0)
NetLPF2_1: R112.2 R113.2 ; port Out
NetR24_1: R24.1 U5.32(RSET)
NetR27_1: R27.1 U5.5(SYNCB)
NetR30_1: R30.1 U5.9(S8)
NetR31_1: R31.1 U5.10(S7)
NetR32_1: R32.1 U5.11(S6)
NetR33_1: R33.1 U5.12(S5)
NetR34_1: R34.1 U5.13(S4)
NetR35_1: R35.1 U5.14(S3)
NetR37_1: R37.1 U5.16(S1)
NetR38_1: R38.1 U5.25(S0)
NetR153_1: R153.1 U5.8(S9)
NetSplt2_9: T1.4 ; port In

Not connected (* = marked no-connect by the designer): U5 18(OUT1B)* 19(OUT1)* 27(DNC) 28(DNC)

### Notes on the sheet
- (near C119) 4dBm
- -21.1dBm
- AttFD(-25.1dB)
- OUT1 OFF
- OUT1 Delay
- VREF = 2/3
- VCC = 1
- Phase offset MSB
- Phase offset LSB
- Phase on/off
- Divide by 2 with phase 0
- Logic = LVPECL 790mV
- Floating = 1/3
- GND = 0
- ESS - Phase Reference Line - Phase Alignment
- Frequency divider
- ML
- 1.
- Title
- Project
- Drawing no.
- Date
- Drawn by
- Checked by
- Revision

### Library data of the parts
BLM8 = BLM15AX121SZ1D: as BLM11 on sheet RF; Case: 0402; Supplier 1: Digi-Key; Supplier Part Number 1: 490-16510-1-ND; HelpURL: https://www.murata.com/en-us/products/productdata/8796748677150/QNFA9118.pdf
C52 = C_1206: as C3 on sheet PhaseDetector; Value: 10uF; Case: 1206
C53 = C_0603: as C76 on sheet RF; Value: 1uF; Case: 0603
C54-C56 C58 C59 C118-C125 = C_0402: as C77 on sheet RF; Value: 100n; Case: 0402
R24-R27 R30-R38 R40 R153 R156 = R_0402: Resistor 0402; Tolerance: ±1%; Case: 0402
  R24 R27: Value: 4.12k
  R25 R36: Value: 200r
  R26 R40: Value: 100r
  R30-R35 R37 R38 R153: Value: 0r
  R156: Value: 49.9r
R39 R41 = R_0402: Resistor 0402; Value: 0r; Tolerance: ±1%; Case: 0402
R111-R113 = R_0603: Resistor 0603; Tolerance: ±1%; Case: 0603
  R111 R113: Value: 54.9r
  R112: Value: 442r
T1 = MABAES0061: 1:4 E-Series, RF Flux Coupled Transformer / 2 - 800 MHz; HelpURL: https://cdn.macom.com/datasheets/MABAES0061.pdf; Case: MABAES0061; Supplier 1: Digi-Key; Supplier Part Number 1: 1465-1318-1-ND; Value: 1:4
U5 = AD9515: 1.6 GHz Clock Distribution IC, Dividers, Delay Adjust, Two Outputs; HelpURL: https://www.analog.com/media/en/technical-documentation/data-sheets/AD9515.pdf; Case: LFCSP32; Supplier 1: Digi-Key; Supplier Part Number 1: AD9515BCPZ-REEL7CT-ND

## Sheet DAC.SchDoc
size 193 x 146 mm; DocumentNumber: 1; SheetNumber: 1; SheetTotal: 11
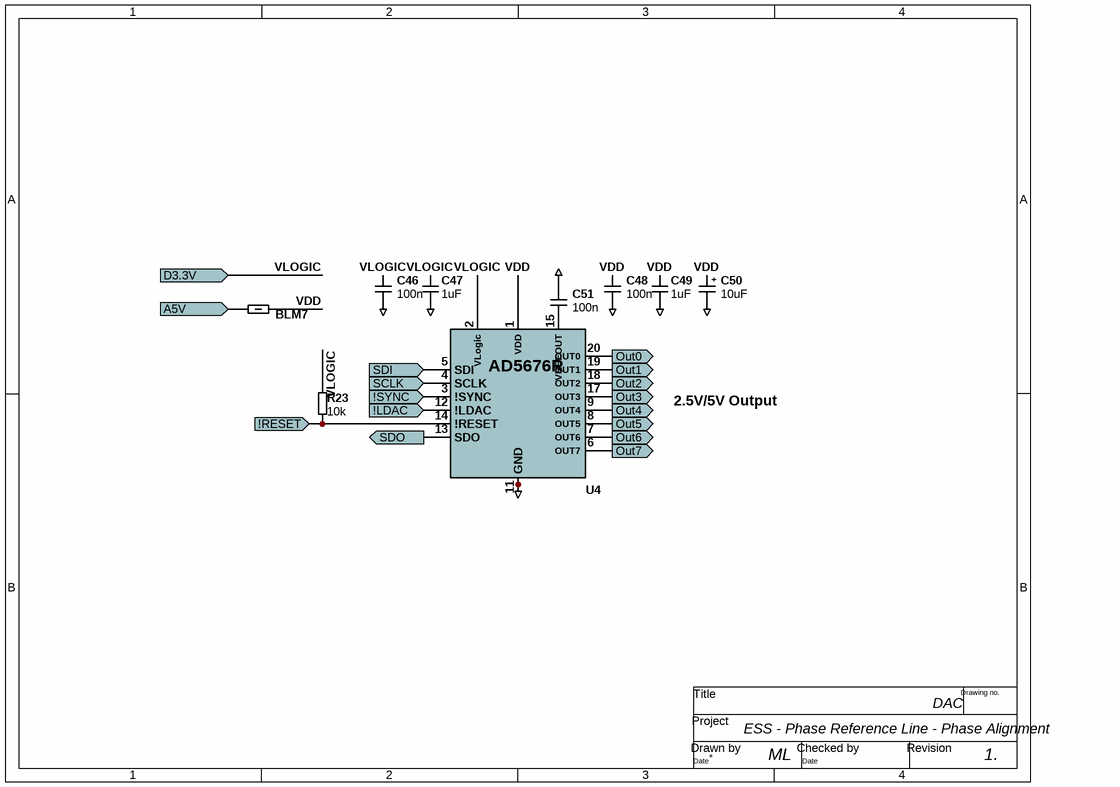
[diagram p4: DAC.SchDoc]

### Parts
BLM7  120 Ohms @ 100MHz  [0402-Inductor]  (value not drawn)
C46  100n  [0402-Capacitor]  (net tie, no BOM)
C47  1uF  [0805-Capacitor]
C48  100n  [0402-Capacitor]  (net tie, no BOM)
C49  1uF  [0805-Capacitor]
C50  10uF  [1206-cap_tant]
C51  100n  [0402-Capacitor]  (net tie, no BOM)
R23  10k  [0402-RESISTOR]
U4  AD5676R  [LFCSP-20]  (value not drawn)

### Ports
!LDAC (in), !RESET (in), !SYNC (in), A5V (in), D3.3V (in), Out0 (out), Out1 (out), Out2 (out), Out3 (out), Out4 (out), Out5 (out), Out6 (out), Out7 (out), SCLK (in), SDI (in), SDO (out)

### Nets
A5V: BLM7.1 ; port A5V
GND: C46.1 C47.2 C48.1 C49.2 C50.2(-) C51.2 U4.11(GND) U4.EP  [project net DGND]
VLOGIC: C46.2 C47.1 R23.1 U4.2(VLogic) ; port D3.3V  [project net D3.3V]
A: U4.19(OUT1) ; port Out1
B: U4.6(OUT7) ; port Out7
C: U4.7(OUT6) ; port Out6
D: U4.20(OUT0) ; port Out0
E: U4.17(OUT3) ; port Out3
F: U4.18(OUT2) ; port Out2
G: U4.8(OUT5) ; port Out5
H: U4.9(OUT4) ; port Out4
VDD: BLM7.2 C48.2 C49.1 C50.1(+) U4.1(VDD)  [project net VDD_1]
NetC51_1: C51.1 U4.15(VREFOUT)
NetR23_2: R23.2 U4.14(!RESET) ; port !RESET
NetR86_1: U4.5(SDI) ; port SDI
NetR87_1: U4.13(SDO) ; port SDO
NetR88_1: U4.4(SCLK) ; port SCLK
NetR89_1: U4.3(!SYNC) ; port !SYNC
NetR107_1: U4.12(!LDAC) ; port !LDAC

Not connected (* = marked no-connect by the designer): U4 10(NC) 16(NC)

### Notes on the sheet
- 2.5V/5V Output
- ESS - Phase Reference Line - Phase Alignment
- DAC
- ML
- 1.
- Title
- Project
- Drawing no.
- Date
- Drawn by
- Checked by
- Revision

### Library data of the parts
BLM7 = BLM15AX121SZ1D: as BLM11 on sheet RF; Case: 0402; Supplier 1: Digi-Key; Supplier Part Number 1: 490-16510-1-ND; HelpURL: https://www.murata.com/en-us/products/productdata/8796748677150/QNFA9118.pdf
C46 C48 = C_0402: Capacitor 0402; Dielectric: X7R/C0G; Tolerance: ±20%; Voltage Rating: 16V; Value: 100n; Case: 0402
C47 C49 = C_0805: Capacitor 0805; Dielectric: X7R/C0G; Tolerance: ±20%; Voltage Rating: 16V; Value: 1uF; Case: 0805
C50 = C_10uF_Tant_16V_1206: CAP TANT 10UF 10% 16V 1206; Value: 10uF; Voltage Rating: 16V; Supplier 1: Digi-Key; Supplier Part Number 1: 399-8269-1-ND; Case: 1206
C51 = C_0402: as C77 on sheet RF; Value: 100n; Case: 0402
R23 = R_0402: Resistor 0402; Tolerance: ±1%; Value: 10k; Case: 0402
U4 = AD5676R: Octal, 16-Bit nanoDAC+ with 2 ppm/°C Reference, SPI Interface /; HelpURL: https://www.analog.com/media/en/technical-documentation/data-sheets/ad5672r_5676r.pdf; Case: 20-WFQFN Exposed Pad, CSP; Supplier 1: Digi-Key; Supplier Part Number 1: AD5676RACPZ-REEL7CT-ND

## Sheet ADC.SchDoc
size 292 x 193 mm; DocumentNumber: 3; SheetNumber: 3; SheetTotal: 11
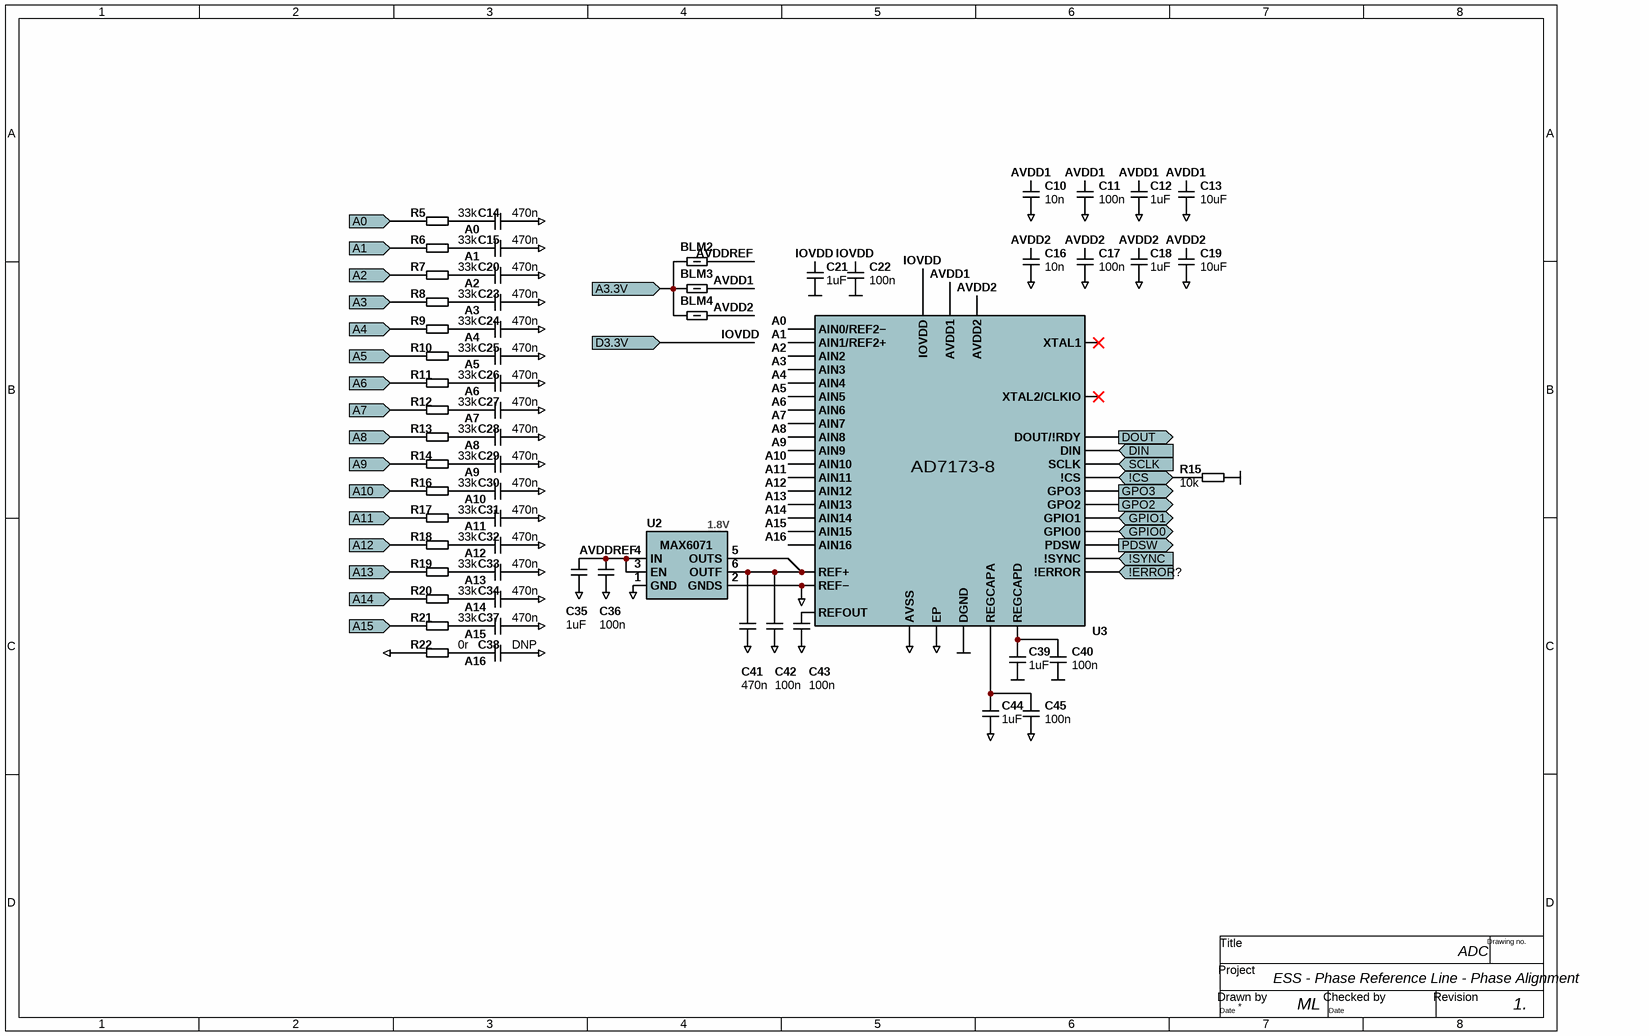
[diagram p5: ADC.SchDoc]

### Parts
BLM2  120 Ohms @ 100MHz  [0402-Inductor]  (value not drawn)
BLM3  120 Ohms @ 100MHz  [0402-Inductor]  (value not drawn)
BLM4  120 Ohms @ 100MHz  [0402-Inductor]  (value not drawn)
C10  10n  [0402-Capacitor]  (net tie, no BOM)
C11  100n  [0402-Capacitor]  (net tie, no BOM)
C12  1uF  [0805-Capacitor]
C13  10uF  [1206-capacitor]
C14  470n  [0402-Capacitor]
C15  470n  [0402-Capacitor]
C16  10n  [0402-Capacitor]  (net tie, no BOM)
C17  100n  [0402-Capacitor]  (net tie, no BOM)
C18  1uF  [0805-Capacitor]
C19  10uF  [1206-capacitor]
C20  470n  [0402-Capacitor]
C21  1uF  [0805-Capacitor]
C22  100n  [0402-Capacitor]  (net tie, no BOM)
C23  470n  [0402-Capacitor]
C24  470n  [0402-Capacitor]
C25  470n  [0402-Capacitor]
C26  470n  [0402-Capacitor]
C27  470n  [0402-Capacitor]
C28  470n  [0402-Capacitor]
C29  470n  [0402-Capacitor]
C30  470n  [0402-Capacitor]
C31  470n  [0402-Capacitor]
C32  470n  [0402-Capacitor]
C33  470n  [0402-Capacitor]
C34  470n  [0402-Capacitor]
C35  1uF  [0805-Capacitor]
C36  100n  [0402-Capacitor]  (net tie, no BOM)
C37  470n  [0402-Capacitor]
C38  DNP  [0402-Capacitor]  (net tie, no BOM)
C39  1uF  [0805-Capacitor]
C40  100n  [0402-Capacitor]  (net tie, no BOM)
C41  470n  [0402-Capacitor]  (net tie, no BOM)
C42  100n  [0402-Capacitor]  (net tie, no BOM)
C43  100n  [0402-Capacitor]  (net tie, no BOM)
C44  1uF  [0805-Capacitor]
C45  100n  [0402-Capacitor]  (net tie, no BOM)
R5  33k  [0402-RESISTOR]
R6  33k  [0402-RESISTOR]
R7  33k  [0402-RESISTOR]
R8  33k  [0402-RESISTOR]
R9  33k  [0402-RESISTOR]
R10  33k  [0402-RESISTOR]
R11  33k  [0402-RESISTOR]
R12  33k  [0402-RESISTOR]
R13  33k  [0402-RESISTOR]
R14  33k  [0402-RESISTOR]
R15  10k  [0603-RESISTOR]
R16  33k  [0402-RESISTOR]
R17  33k  [0402-RESISTOR]
R18  33k  [0402-RESISTOR]
R19  33k  [0402-RESISTOR]
R20  33k  [0402-RESISTOR]
R21  33k  [0402-RESISTOR]
R22  0r  [0402-RESISTOR]
U2  MAX6071  [SOT-23-6]  (value not drawn)
U3  AD7173-8  [LFCSP-40]  (value not drawn)

### Ports
!CS (bidir), !ERROR? (in), !SYNC (in), A0 (in), A1 (in), A2 (in), A3 (in), A3.3V (in), A4 (in), A5 (in), A6 (in), A7 (in), A8 (in), A9 (in), A10 (in), A11 (in), A12 (in), A13 (in), A14 (in), A15 (in), D3.3V (in), DIN (in), DOUT (out), GPIO0 (bidir), GPIO1 (bidir), GPO2 (out), GPO3 (out), PDSW (out), SCLK (in)

### Nets
DGND: C10.1 C11.1 C12.2 C13.2 C14.2 C15.2 C16.1 C17.1 C18.2 C19.2 C20.2 C21.2 C22.1 C23.2 C24.2 C25.2 C26.2 C27.2 C28.2 C29.2 C30.2 C31.2 C32.2 C33.2 C34.2 C35.2 C36.1 C37.2 C38.2 C39.2 C40.1 C41.1 C42.1 C43.1 C44.2 C45.1 R15.2 R22.1 U2.1(GND) U2.2(GNDS) U3.8(AVSS) U3.21(DGND) U3.39(REF−) U3.EP  [also labelled GND]
IOVDD: C21.1 C22.2 U3.20(IOVDD) ; port D3.3V  [project net D3.3V]
A0: C14.1 R5.2 U3.2(AIN0/REF2−)  [project net A0_3]
A1: C15.1 R6.2 U3.3(AIN1/REF2+)  [project net A1_3]
A2: C20.1 R7.2 U3.4(AIN2)  [project net A2_3]
A3: C23.1 R8.2 U3.5(AIN3)  [project net A3_3]
A3.3V_ADC: BLM2.1 BLM3.1 BLM4.1 ; port A3.3V
A4: C24.1 R9.2 U3.26(AIN4)  [project net A4_3]
A5: C25.1 R10.2 U3.27(AIN5)  [project net A5_3]
A6: C26.1 R11.2 U3.28(AIN6)  [project net A6_3]
A7: C27.1 R12.2 U3.29(AIN7)  [project net A7_3]
A8: C28.1 R13.2 U3.30(AIN8)  [project net A8_3]
A9: C29.1 R14.2 U3.31(AIN9)  [project net A9_3]
A10: C30.1 R16.2 U3.32(AIN10)  [project net A10_3]
A11: C31.1 R17.2 U3.33(AIN11)  [project net A11_3]
A12: C32.1 R18.2 U3.34(AIN12)  [project net A12_3]
A13: C33.1 R19.2 U3.35(AIN13)  [project net A13_3]
A14: C34.1 R20.2 U3.36(AIN14)  [project net A14_3]
A15: C37.1 R21.2 U3.37(AIN15)  [project net A15_3]
A16: C38.1 R22.2 U3.1(AIN16)  [project net A16_3]
AMP352_P: R14.1 ; port A9
AMP704_P: R16.1 ; port A10
AVDD1: BLM3.2 C10.2 C11.2 C12.1 C13.1 U3.9(AVDD1)  [project net AVDD1_3]
AVDD2: BLM4.2 C16.2 C17.2 C18.1 C19.1 U3.10(AVDD2)  [project net AVDD2_3]
AVDDREF: BLM2.2 C35.1 C36.2 U2.3(EN) U2.4(IN)  [project net AVDDREF_3]
MO352_P: R21.1 ; port A15
MO704_P: R9.1 ; port A4
PD0MAG: R18.1 ; port A12
PD0PHS: R17.1 ; port A11
PD1MAG: R10.1 ; port A5
PD1PHS: R11.1 ; port A6
PD2MAG: R6.1 ; port A1
PD2PHS: R5.1 ; port A0
PD3MAG: R19.1 ; port A13
PD3PHS: R20.1 ; port A14
PD4MAG: R8.1 ; port A3
PD4PHS: R7.1 ; port A2
RH: R13.1 ; port A8
T: R12.1 ; port A7
NetC39_1: C39.1 C40.2 U3.22(REGCAPD)
NetC41_2: C41.2 C42.2 U2.5(OUTS) U2.6(OUTF) U3.40(REF+)
NetC43_2: C43.2 U3.6(REFOUT)
NetC44_1: C44.1 C45.2 U3.7(REGCAPA)
NetR15_1: R15.1 U3.17(!CS) ; port !CS
NetR83_1: U3.16(SCLK) ; port SCLK
NetR84_1: U3.15(DIN) ; port DIN
NetR85_1: U3.14(DOUT/!RDY) ; port DOUT
NetR105_1: U3.18(!ERROR) ; port !ERROR?
NetR106_1: U3.19(!SYNC) ; port !SYNC
NetU3_11: U3.11(PDSW) ; port PDSW
NetU3_23: U3.23(GPIO0) ; port GPIO0
NetU3_24: U3.24(GPIO1) ; port GPIO1
NetU3_25: U3.25(GPO2) ; port GPO2
NetU3_38: U3.38(GPO3) ; port GPO3

Not connected (* = marked no-connect by the designer): U3 12(XTAL1)* 13(XTAL2/CLKIO)*

### Notes on the sheet
- (near U2) 1.8V
- ESS - Phase Reference Line - Phase Alignment
- ADC
- ML
- 1.
- Title
- Project
- Drawing no.
- Date
- Drawn by
- Checked by
- Revision

### Library data of the parts
BLM2-BLM4 = BLM15AX121SZ1D: as BLM11 on sheet RF; Case: 0402; Supplier 1: Digi-Key; Supplier Part Number 1: 490-16510-1-ND; HelpURL: https://www.murata.com/en-us/products/productdata/8796748677150/QNFA9118.pdf
C10 C11 C14-C17 C20 C22-C34 C36 C37 C40-C43 C45 = C_0402: as C46 on sheet DAC; Case: 0402
  C10 C16: Value: 10n
  C11 C17 C22 C36 C40 C42 C43 C45: Value: 100n
  C14 C15 C20 C23-C34 C37 C41: Value: 470n
C12 C18 C21 C35 C39 C44 = C_0805: as C47 on sheet DAC; Value: 1uF; Case: 0805
C13 C19 = C_1206: Capacitor 1206; Voltage Rating: 16V; Dielectric: X7R/C0G; Tolerance: ±20%; Value: 10uF; Case: 1206
C38 = C_0402: Capacitor 0402; Value: 470n; Dielectric: X7R/C0G; Tolerance: ±20%; Voltage Rating: 16V; Case: 0402
R5-R14 R16-R22 = R_0402: Resistor 0402; Tolerance: ±1%; Case: 0402
  R5-R14 R16-R21: Value: 33k
  R22: Value: 0r
R15 = R_0603: Resistor 0603; Tolerance: ±1%; Value: 10k; Case: 0603
U2 = MAX6071-1.8: Low-Noise, High-Precision Series / 1.8V Voltage Reference; Case: SOT23-6; HelpURL: https://datasheets.maximintegrated.com/en/ds/MAX6070-MAX6071.pdf; Supplier Part Number 1: 3257466; Supplier 1: Farnel
U3 = AD7173-8: Highly Integrated 24 Bit Sigma-Delta ADC / 8-/16-Channel / Low Power / 31.25 kSPS; Case: LFCSP40; HelpURL: https://www.analog.com/media/en/technical-documentation/data-sheets/AD7173-8.pdf; Supplier Part Number 1: 2377349

## Sheet PowerDetector.SchDoc
size 292 x 193 mm; DocumentNumber: 6; SheetNumber: 6; SheetTotal: 11
Used 4 times, as channels PWD0, PWD1, PWD2, PWD3. Parts and nets are listed once, with the designators drawn on the sheet.
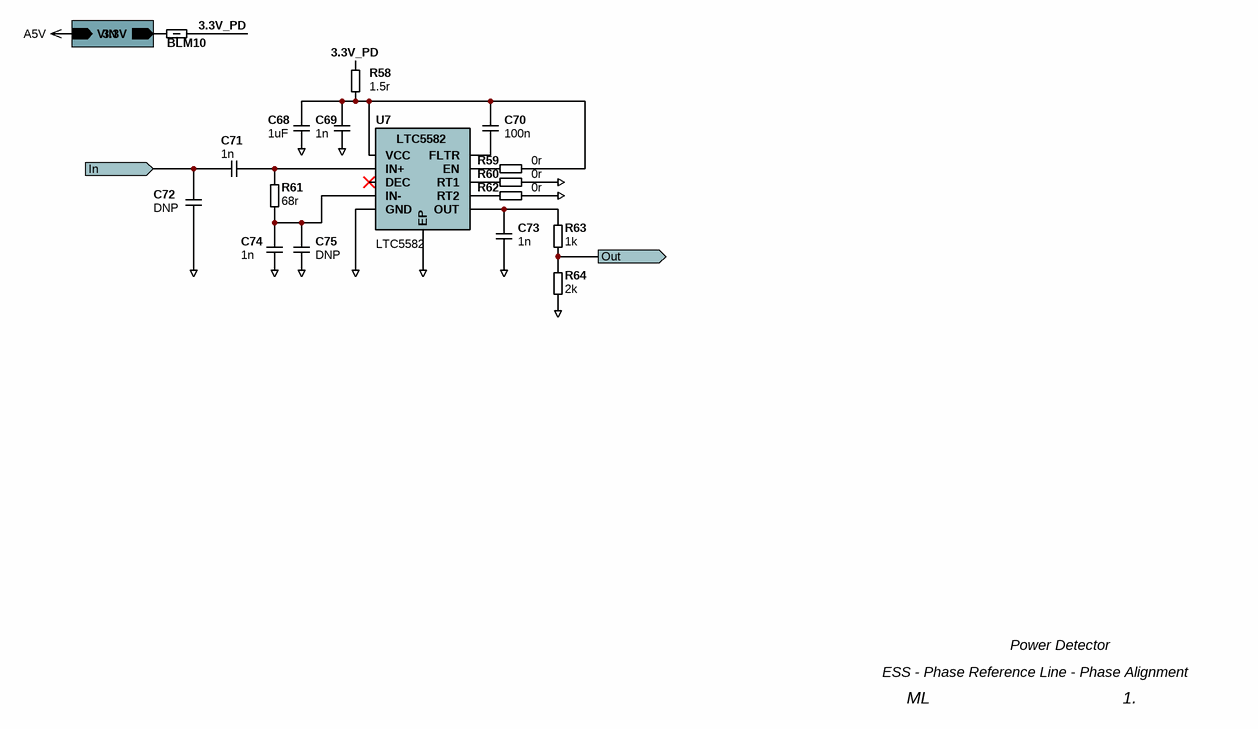
[diagram p6: PowerDetector.SchDoc]

### Parts
BLM10  120 Ohms @ 100MHz  [0402-Inductor]  (value not drawn)
C68  1uF  [0805-Capacitor]
C69  1n  [0603-Capacitor]
C70  100n  [0603-Capacitor]
C71  1n  [0402-Capacitor]
C72  DNP  [0402-Capacitor]  (no BOM)
C73  1n  [0402-Capacitor]
C74  1n  [0402-Capacitor]
C75  DNP  [0402-Capacitor]  (no BOM)
R58  1.5r  [0603-RESISTOR]
R59  0r  [0402-RESISTOR]
R60  0r  [0402-RESISTOR]
R61  68r  [0402-RESISTOR]
R62  0r  [0402-RESISTOR]
R63  1k  [0402-RESISTOR]
R64  2k  [0402-RESISTOR]
U7  LTC5582  [LT-DFN10]

### Sub-sheets
A3.3V_PD = LDO3v3.SchDoc: 3.3V (out), VIN (in)

### Ports
In (in), Out (out)

### Nets
GND: C68.2 C69.2 C72.2 C73.2 C74.2 C75.2 R60.1 R62.1 R64.2 U7.5(GND) U7.11(EP)
3.3V_PD: BLM10.1 R58.2  [project net 3.3V_PD_6]
In: C71.1 C72.1 ; port In
Out: R63.2 R64.1 ; port Out
NetBLM10_2: BLM10.2 ; sheet A3.3V_PD/3.3V
NetC68_1: C68.1 C69.1 C70.1 R58.1 R59.1 U7.1(VCC)
NetC70_2: C70.2 U7.10(FLTR)
NetC71_2: C71.2 R61.1 U7.2(IN+)
NetC73_1: C73.1 R63.1 U7.6(OUT)
NetC74_1: C74.1 C75.1 R61.2 U7.4(IN-)
NetR59_2: R59.2 U7.9(EN)
NetR60_2: R60.2 U7.8(RT1)
NetR62_2: R62.2 U7.7(RT2)

Not connected (* = marked no-connect by the designer): U7 3(DEC)*

### Channels
PWD0: designators end in _PWD0; ports In=NetC71_PWD0_1 Out=MO704_P
PWD1: designators end in _PWD1; ports In=NetC71_PWD1_1 Out=AMP704_P
PWD2: designators end in _PWD2; ports In=NetC71_PWD2_1 Out=AMP352_P
PWD3: designators end in _PWD3; ports In=NetC71_PWD3_1 Out=MO352_P

### Notes on the sheet
- ESS - Phase Reference Line - Phase Alignment
- Power Detector
- ML
- 1.
- Title
- Project
- Drawing no.
- Date
- Drawn by
- Checked by
- Revision

### Library data of the parts
BLM10 = BLM15AX121SZ1D: as BLM11 on sheet RF; Case: 0402; Supplier 1: Digi-Key; Supplier Part Number 1: 490-16510-1-ND; HelpURL: https://www.murata.com/en-us/products/productdata/8796748677150/QNFA9118.pdf
C68 = C_0805: Capacitor 0805; Tolerance: ±20%; Voltage Rating: 16V; Dielectric: X7R/C0G; Value: 1uF; Case: 0805
C69 C70 = C_0603: as C76 on sheet RF; Case: 0603
  C69: Value: 1n
  C70: Value: 100n
C71-C75 = C_0402: as C77 on sheet RF; Case: 0402
  C71 C73 C74: Value: 1n
  C72 C75: Value: DNP
R58 = R_0603: Resistor 0603; Tolerance: ±1%; Value: 1.5r; Case: 0603
R59-R64 = R_0402: Resistor 0402; Tolerance: ±1%; Case: 0402
  R59 R60 R62: Value: 0r
  R61: Value: 68r
  R63: Value: 1k
  R64: Value: 2k
U7 = LTC5582: 40MHz to 10GHz RMS Power Detector with 57dB Dynamic Range; HelpURL: https://www.analog.com/media/en/technical-documentation/data-sheets/LTC5582.pdf; Supplier 1: DigiKey; Supplier Part Number 1: LTC5582IDD#PBF-ND

## Sheet Power.SchDoc
size 292 x 193 mm; DocumentNumber: 10; SheetNumber: 10; SheetTotal: 11
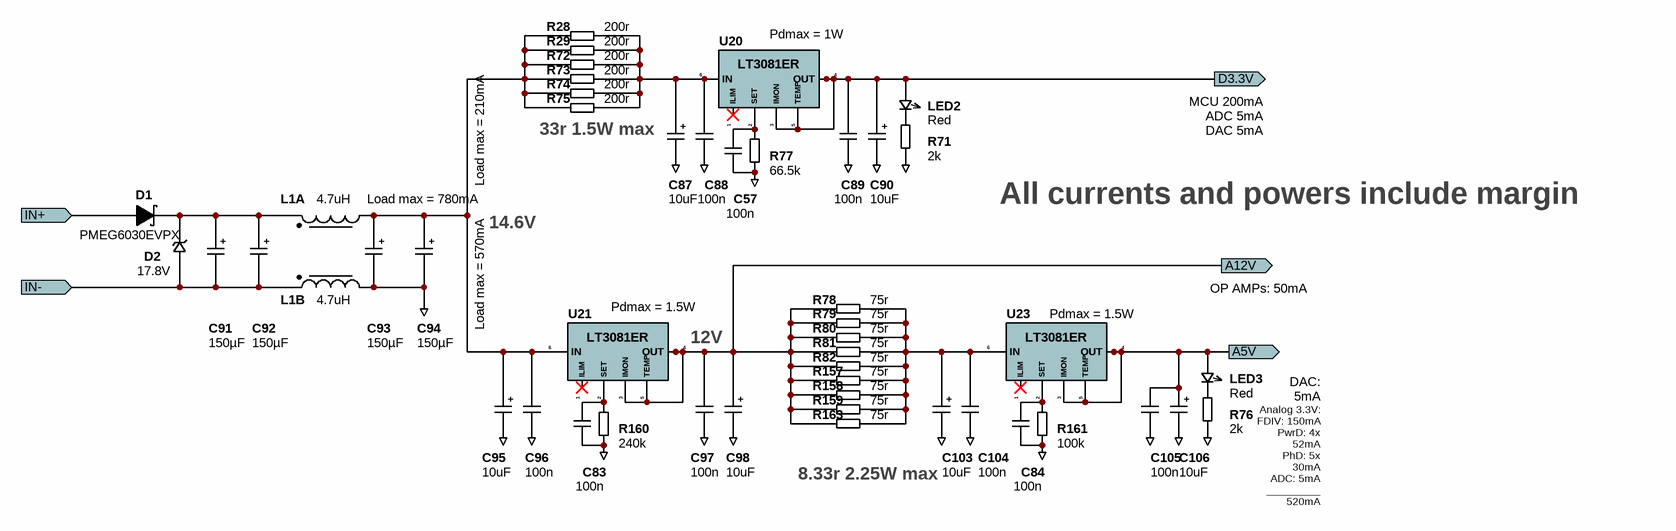
[diagram p7: Power.SchDoc]

### Parts
C57  100n  [0402-Capacitor]  (net tie, no BOM)
C83  100n  [0402-Capacitor]
C84  100n  [0402-Capacitor]  (net tie, no BOM)
C87  10uF  [2312-6032 Tantalum Capacitor]
C88  100n  [0402-Capacitor]  (net tie, no BOM)
C89  100n  [0402-Capacitor]  (net tie, no BOM)
C90  10uF  [2312-6032 Tantalum Capacitor]
C91  150µF  [2917-7343  Tantalum Capacitor]
C92  150µF  [2917-7343  Tantalum Capacitor]
C93  150µF  [2917-7343  Tantalum Capacitor]
C94  150µF  [2917-7343  Tantalum Capacitor]
C95  10uF  [2312-6032 Tantalum Capacitor]
C96  100n  [0402-Capacitor]  (net tie, no BOM)
C97  100n  [0402-Capacitor]  (net tie, no BOM)
C98  10uF  [2312-6032 Tantalum Capacitor]
C103  10uF  [2312-6032 Tantalum Capacitor]
C104  100n  [0402-Capacitor]  (net tie, no BOM)
C105  100n  [0402-Capacitor]  (net tie, no BOM)
C106  10uF  [2312-6032 Tantalum Capacitor]
D1  PMEG6030EVPX  [SOD128]
D2  17.8V  [DO-219AB]
L1  4.7uH  [LPD5030]  (parts A,B of 2)
LED2  Red  [LED0603]
LED3  Red  [LED0603]
R28  200r  [1210-Resistor]
R29  200r  [1210-Resistor]
R71  2k  [0402-RESISTOR]
R72  200r  [1210-Resistor]
R73  200r  [1210-Resistor]
R74  200r  [1210-Resistor]
R75  200r  [1210-Resistor]
R76  2k  [0402-RESISTOR]
R77  66.5k  [0805-Resistor]
R78  75r  [1210-Resistor]
R79  75r  [1210-Resistor]
R80  75r  [1210-Resistor]
R81  75r  [1210-Resistor]
R82  75r  [1210-Resistor]
R157  75r  [1210-Resistor]
R158  75r  [1210-Resistor]
R159  75r  [1210-Resistor]
R160  240k  [0805-Resistor]
R161  100k  [0805-Resistor]
R163  75r  [1210-Resistor]
U20  ADJ  [D2PAK7]  (value not drawn)
U21  ADJ  [D2PAK7]  (value not drawn)
U23  ADJ  [D2PAK7]  (value not drawn)

### Ports
A5V (out), A12V (out), D3.3V (out), IN+ (in), IN- (in)

### Nets
A5V: C105.2 C106.+ LED3.A U23.3(IMON) U23.4(OUT) U23.5(TEMP) U23.EP(OUT) ; port A5V
A12V: C97.2 C98.+ R78.1 R79.1 R80.1 R81.1 R82.1 R157.1 R158.1 R159.1 R163.1 U21.3(IMON) U21.4(OUT) U21.5(TEMP) U21.EP(OUT) ; port A12V
D3.3V: C89.2 C90.+ LED2.A U20.3(IMON) U20.4(OUT) U20.5(TEMP) U20.EP(OUT) ; port D3.3V
GND: C57.1 C83.1 C84.1 C87.- C88.1 C89.1 C90.- C93.- C94.- C95.- C96.1 C97.1 C98.- C103.- C104.1 C105.1 C106.- L1.3 R71.1 R76.1 R77.1 R160.1 R161.1  [project net DGND]
PWR+: D1.1(A) ; port IN+
PWR-: C91.- C92.- D2.A L1.4 ; port IN-
NetC57_2: C57.2 R77.2 U20.2(SET)
NetC83_2: C83.2 R160.2 U21.2(SET)
NetC84_2: C84.2 R161.2 U23.2(SET)
NetC87_+: C87.+ C88.2 R28.2 R29.2 R72.2 R73.2 R74.2 R75.2 U20.6(IN)
NetC91_+: C91.+ C92.+ D1.2(K) D2.K L1.1
NetC93_+: C93.+ C94.+ C95.+ C96.2 L1.2 R28.1 R29.1 R72.1 R73.1 R74.1 R75.1 U21.6(IN)
NetC103_+: C103.+ C104.2 R78.2 R79.2 R80.2 R81.2 R82.2 R157.2 R158.2 R159.2 R163.2 U23.6(IN)
NetLED2_K: LED2.K R71.2
NetLED3_K: LED3.K R76.2

Not connected (* = marked no-connect by the designer): U20 1(ILIM)* 7(NC); U21 1(ILIM)* 7(NC); U23 1(ILIM)* 7(NC)

### Notes on the sheet
- (near U20) Pdmax = 1W
- (near R75) 33r 1.5W max
- MCU 200mA
  ADC 5mA
  DAC 5mA
- (near L1) Load max = 780mA
- Load max = 210mA
- 14.6V
- All currents and powers include margin
- (near U21) Pdmax = 1.5W
- (near U23) Pdmax = 1.5W
- OP AMPs: 50mA
- Load max = 570mA
- (near U21) 12V
- DAC: 5mA
  ATT: 2mA
- 8.33r 2.25W max
- Analog 3.3V:
  FDIV: 150mA
  PwrD: 4x 52mA
  PhD: 5x 30mA
  ADC: 5mA
  _________
  520mA
- Title
- Project
- Drawing no.
- Date
- Drawn by
- Checked by
- Revision

### Library data of the parts
C57 C83 C84 C88 C89 C96 C97 C104 C105 = C_0402: as C77 on sheet RF; Value: 100n; Case: 0402
C87 C90 C95 C98 C103 C106 = C_10uF_Tant_25V_2312: CAP TANT 10UF 10% 25V 2312; Value: 10uF; Voltage Rating: 25V; Supplier 1: Digi-Key; Supplier Part Number 1: 399-3734-1-ND; Case: 2312; HelpURL: https://content.kemet.com/datasheets/KEM_T2005_T491.pdf
C91-C94 = T491X157K020AT: 150µF Molded Tantalum Capacitors 20V 2917; Tolerance: ±10%; Value: 150µF; Voltage Rating: 20V; Supplier 1: Digi-Key; Supplier Part Number 1: 399-4794-1-ND; Case: 2917; HelpURL: https://content.kemet.com/datasheets/KEM_T2005_T491.pdf
D1 = PMEG6030EVPX: Diode Schottky 60V 3A Surface Mount SOD-128/CFP5; Manufacturer: Nexperia USA Inc.; Pin Count: 2; Package: SOD128; ManufacturerNr: PMEG6030EVPX; HelpURL: https://assets.nexperia.com/documents/data-sheet/PMEG6030EVP.pdf; Supplier 1: Digi-Key; Supplier Part Number 1: 1727-1349-1-ND
D2 = SMF16A-E3-08: 26V Clamp 7.7A Ipp Tvs Diode Surface Mount SMF; HelpURL: http://www.vishay.com/docs/85881/smf5v0atosmf58a.pdf; Case: DO-219AB; Supplier 1: Digi-Key; Supplier Part Number 1: SMF16A-E3-08GICT-ND
L1 = LPD5030: Shielded Coupled Inductor; Voltage Rating: 100 V; Tolerance: 20%; HelpURL: http://www.farnell.com/datasheets/1862246.pdf?_ga=2.57899747.877596875.1505932278-516227586.1495631175; Supplier 1: Farnell; Supplier Part Number 1: 2434738; Value: 4.7uH; Case: LPD5030
LED2 LED3 = LED0603: Color: Red; Case: 0603
R28 R29 R72-R75 R78-R82 R157-R159 R163 = R_1210: Resistor 1210; Tolerance: ±1%; Case: 1210
  R28 R29 R72-R75: Value: 200r
  R78-R82 R157-R159 R163: Value: 75r
R71 R76 = R_0402: Resistor 0402; Tolerance: ±1%; Value: 2k; Case: 0402
R77 R160 R161 = R_0805: Resistor 0805; Tolerance: ±1%; Case: 0805
  R77: Value: 66.5k
  R160: Value: 240k
  R161: Value: 100k
U20 U21 U23 = LT3081ER: 1.5A Single Resistor / Rugged Linear Regulator / with Monitors; HelpURL: analog.com/media/en/technical-documentation/data-sheets/3081fc.pdf; Case: 7-DDPAK; Supplier 1: Digi-Key; Supplier Part Number 1: LT3081ER#PBF-ND